# EAGLE design controller (EAGLE 6.6.0)
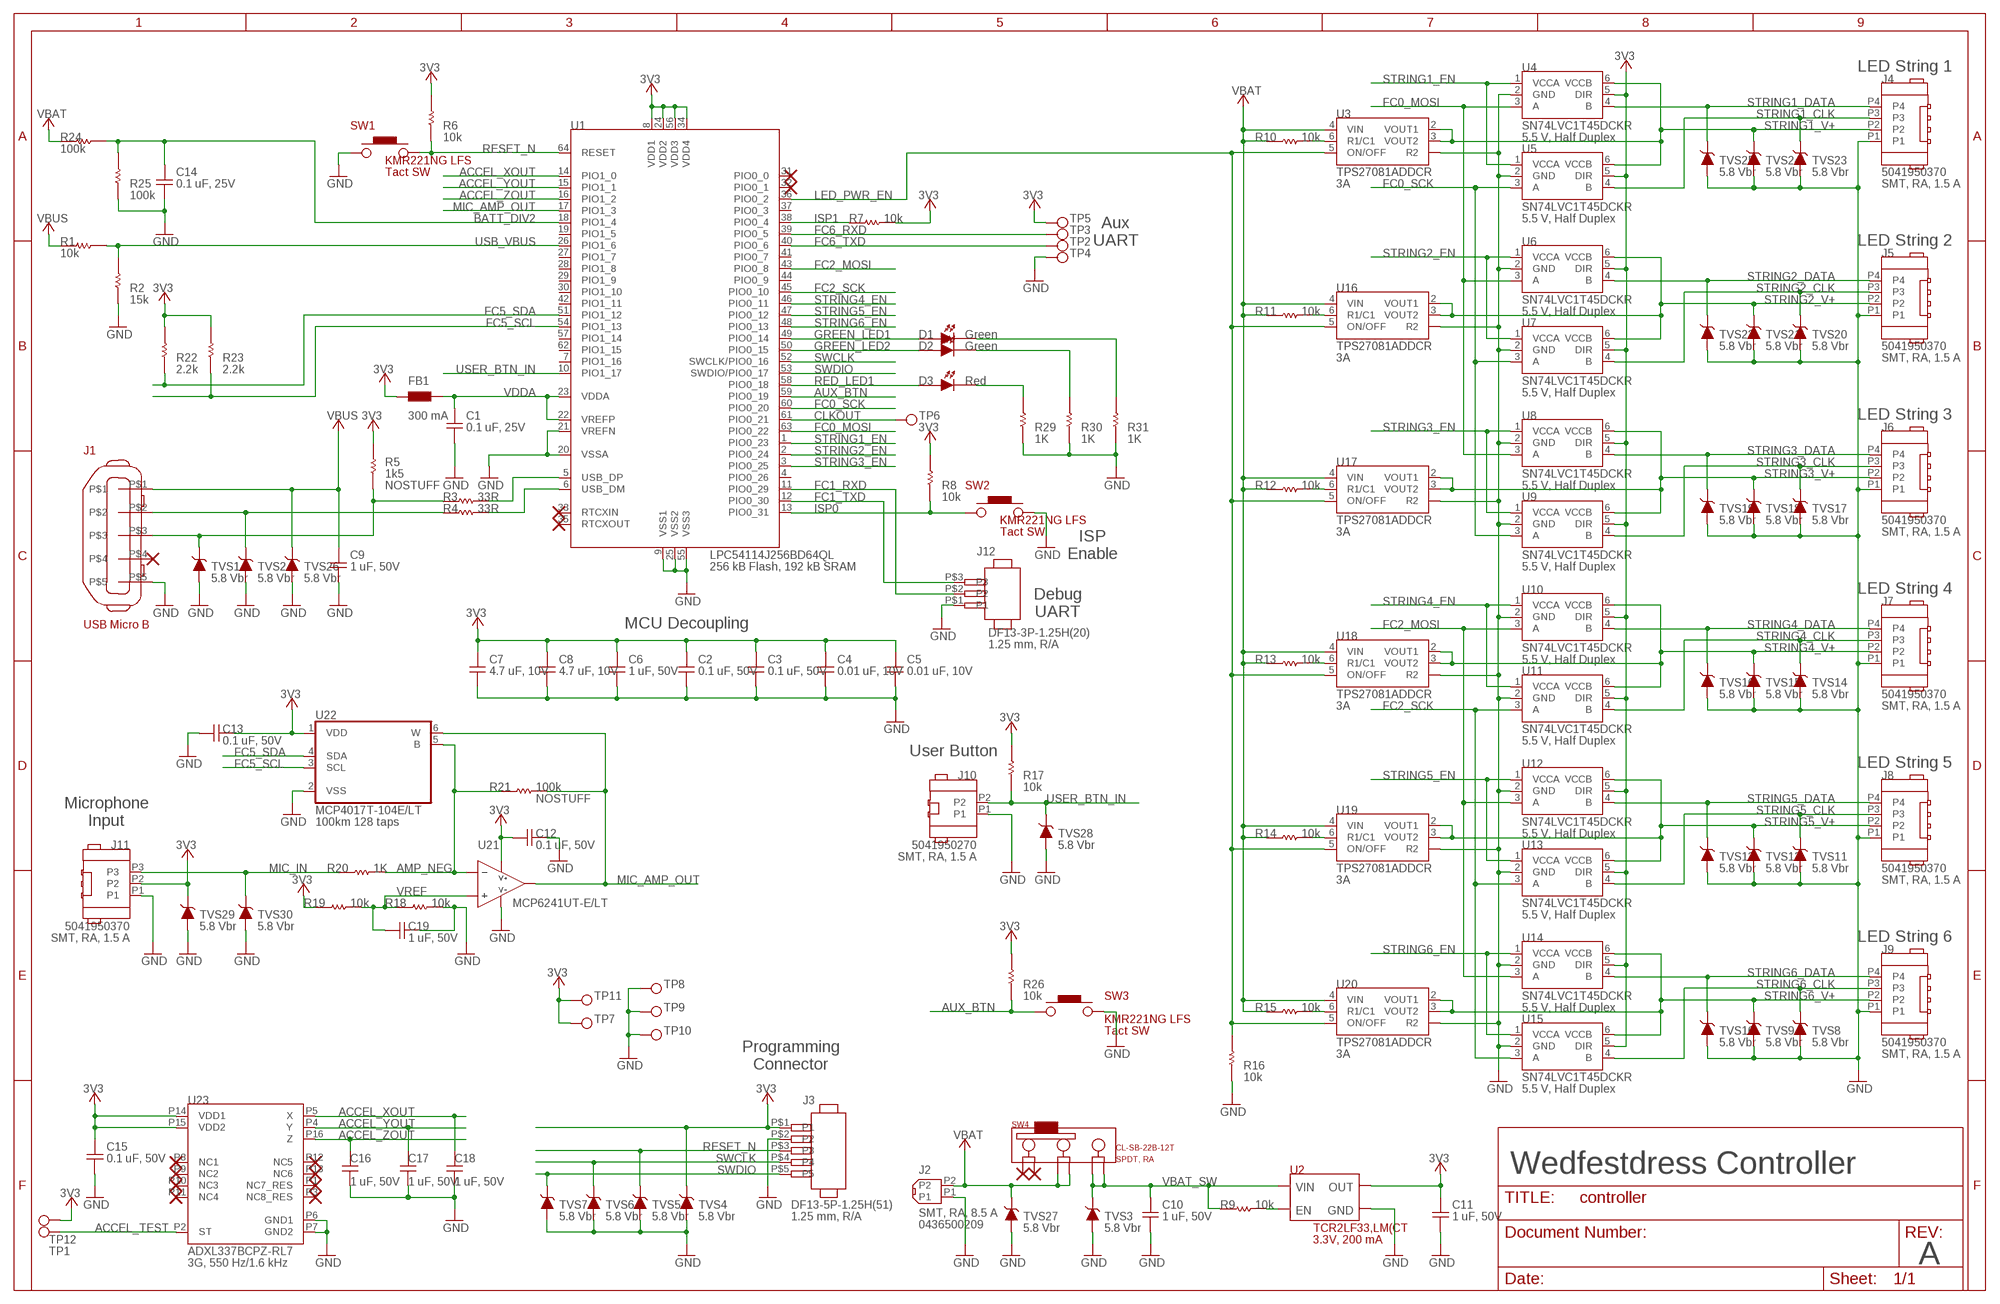
[diagram p0: schematic, sheet 1]

## Parts
C1  CAP_GRM188R71E104KA01D  [CAP_0603]
C2  CAP_C1608X7R1H104K080AA  [CAP_0603]
C3  CAP_C1608X7R1H104K080AA  [CAP_0603]
C4  CAP_CL10B103KB8NNNC  [CAP_0603]
C5  CAP_CL10B103KB8NNNC  [CAP_0603]
C6  CAP_GRM185R61C105KE44D  [CAP_0603]
C7  CAP_CGB3B1X5R1A475M055AC  [CAP_0603]
C8  CAP_CGB3B1X5R1A475M055AC  [CAP_0603]
C9  CAP_GRM185R61C105KE44D  [CAP_0603]
C10  CAP_GRM185R61C105KE44D  [CAP_0603]
C11  CAP_GRM185R61C105KE44D  [CAP_0603]
C12  CAP_C1608X7R1H104K080AA  [CAP_0603]
C13  CAP_C1608X7R1H104K080AA  [CAP_0603]
C14  CAP_GRM188R71E104KA01D  [CAP_0603]
C15  CAP_C1608X7R1H104K080AA  [CAP_0603]
C16  CAP_GRM185R61C105KE44D  [CAP_0603]
C17  CAP_GRM185R61C105KE44D  [CAP_0603]
C18  CAP_GRM185R61C105KE44D  [CAP_0603]
C19  CAP_GRM185R61C105KE44D  [CAP_0603]
D1  LED_LTST-C190GKT  [LED_0603]
D2  LED_LTST-C190GKT  [LED_0603]
D3  LED_LS_Q976-NR-1  [LED_0603_OSRAM]
FB1  FB_BK1608TS102-T  [FB_0603]
J1  10118192-0001LF  [10118192-0001LF]
J2  MOLEX_0436500209  [MOLEX_MICROFIT_2POS_SMT_RA_W_BOSSES]
J3  DF13-5P-1.25H  [DF13-5P-1.25H]
J4  MOLEX_5041950470  [MOLEX_MICROLOCK_RA_4_POS]
J5  MOLEX_5041950470  [MOLEX_MICROLOCK_RA_4_POS]
J6  MOLEX_5041950470  [MOLEX_MICROLOCK_RA_4_POS]
J7  MOLEX_5041950470  [MOLEX_MICROLOCK_RA_4_POS]
J8  MOLEX_5041950470  [MOLEX_MICROLOCK_RA_4_POS]
J9  MOLEX_5041950470  [MOLEX_MICROLOCK_RA_4_POS]
J10  MOLEX_5041950270  [MOLEX_MICROLOCK_RA_2_POS]
J11  MOLEX_5041950370  [MOLEX_MICROLOCK_RA_3_POS]
J12  DF13-3P-1.25H  [DF13-3P-1.25H]
R1  RES_10K_RC0603FR-0710KL  [RES_0603]
R2  RES_15K_RC0603FR-0715KL  [RES_0603]
R3  RES_33R_RC0603FR-0733RL  [RES_0603]
R4  RES_33R_RC0603FR-0733RL  [RES_0603]
R5  RES_1K5_RC0603FR-071K5L  [RES_0603]
R6  RES_10K_RC0603FR-0710KL  [RES_0603]
R7  RES_10K_RC0603FR-0710KL  [RES_0603]
R8  RES_10K_RC0603FR-0710KL  [RES_0603]
R9  RES_10K_RC0603FR-0710KL  [RES_0603]
R10  RES_10K_RC0603FR-0710KL  [RES_0603]
R11  RES_10K_RC0603FR-0710KL  [RES_0603]
R12  RES_10K_RC0603FR-0710KL  [RES_0603]
R13  RES_10K_RC0603FR-0710KL  [RES_0603]
R14  RES_10K_RC0603FR-0710KL  [RES_0603]
R15  RES_10K_RC0603FR-0710KL  [RES_0603]
R16  RES_10K_RC0603FR-0710KL  [RES_0603]
R17  RES_10K_RC0603FR-0710KL  [RES_0603]
R18  RES_10K_RC0603FR-0710KL  [RES_0603]
R19  RES_10K_RC0603FR-0710KL  [RES_0603]
R20  RES_1K_ERJ-3EKF1001V  [RES_0603]
R21  RES_100K_RC0603FR-07100KL  [RES_0603]
R22  RES_2K2_ERJ-3EKF2201V  [RES_0603]
R23  RES_2K2_ERJ-3EKF2201V  [RES_0603]
R24  RES_100K_RC0603FR-07100KL  [RES_0603]
R25  RES_100K_RC0603FR-07100KL  [RES_0603]
R26  RES_10K_RC0603FR-0710KL  [RES_0603]
R29  RES_1K_ERJ-3EKF1001V  [RES_0603]
R30  RES_1K_ERJ-3EKF1001V  [RES_0603]
R31  RES_1K_ERJ-3EKF1001V  [RES_0603]
SW1  KMR221NG  [KMR2]
SW2  KMR221NG  [KMR2]
SW3  KMR221NG  [KMR2]
SW4  CL-SB-22B-12T  [CL-SB-22B-12T]
TP1  TP_1P6_MM_ROUND  [TP_1P6_MM_ROUND]
TP2  TP_1P6_MM_ROUND  [TP_1P6_MM_ROUND]
TP3  TP_1P6_MM_ROUND  [TP_1P6_MM_ROUND]
TP4  TP_1P6_MM_ROUND  [TP_1P6_MM_ROUND]
TP5  TP_1P6_MM_ROUND  [TP_1P6_MM_ROUND]
TP6  TP_1P6_MM_ROUND  [TP_1P6_MM_ROUND]
TP7  TP_1P6_MM_ROUND  [TP_1P6_MM_ROUND]
TP8  TP_1P6_MM_ROUND  [TP_1P6_MM_ROUND]
TP9  TP_1P6_MM_ROUND  [TP_1P6_MM_ROUND]
TP10  TP_1P6_MM_ROUND  [TP_1P6_MM_ROUND]
TP11  TP_1P6_MM_ROUND  [TP_1P6_MM_ROUND]
TP12  TP_1P6_MM_ROUND  [TP_1P6_MM_ROUND]
TVS1  PESD5V0X1UB,135  [SOD523]
TVS2  PESD5V0X1UB,135  [SOD523]
TVS3  PESD5V0X1UB,135  [SOD523]
TVS4  PESD5V0X1UB,135  [SOD523]
TVS5  PESD5V0X1UB,135  [SOD523]
TVS6  PESD5V0X1UB,135  [SOD523]
TVS7  PESD5V0X1UB,135  [SOD523]
TVS8  PESD5V0X1UB,135  [SOD523]
TVS9  PESD5V0X1UB,135  [SOD523]
TVS10  PESD5V0X1UB,135  [SOD523]
TVS11  PESD5V0X1UB,135  [SOD523]
TVS12  PESD5V0X1UB,135  [SOD523]
TVS13  PESD5V0X1UB,135  [SOD523]
TVS14  PESD5V0X1UB,135  [SOD523]
TVS15  PESD5V0X1UB,135  [SOD523]
TVS16  PESD5V0X1UB,135  [SOD523]
TVS17  PESD5V0X1UB,135  [SOD523]
TVS18  PESD5V0X1UB,135  [SOD523]
TVS19  PESD5V0X1UB,135  [SOD523]
TVS20  PESD5V0X1UB,135  [SOD523]
TVS21  PESD5V0X1UB,135  [SOD523]
TVS22  PESD5V0X1UB,135  [SOD523]
TVS23  PESD5V0X1UB,135  [SOD523]
TVS24  PESD5V0X1UB,135  [SOD523]
TVS25  PESD5V0X1UB,135  [SOD523]
TVS26  PESD5V0X1UB,135  [SOD523]
TVS27  PESD5V0X1UB,135  [SOD523]
TVS28  PESD5V0X1UB,135  [SOD523]
TVS29  PESD5V0X1UB,135  [SOD523]
TVS30  PESD5V0X1UB,135  [SOD523]
U1  LPC54114J256BD64  [LQFP64_0P5MM_10X10MM]
U2  TCR2LF33,LM(CT  [TOSHIBA_SMV]
U3  TPS27081  [SOT-23-6_GENERIC]
U4  SN74LVC1T45DCKR  [SC-70-6_GENERIC]
U5  SN74LVC1T45DCKR  [SC-70-6_GENERIC]
U6  SN74LVC1T45DCKR  [SC-70-6_GENERIC]
U7  SN74LVC1T45DCKR  [SC-70-6_GENERIC]
U8  SN74LVC1T45DCKR  [SC-70-6_GENERIC]
U9  SN74LVC1T45DCKR  [SC-70-6_GENERIC]
U10  SN74LVC1T45DCKR  [SC-70-6_GENERIC]
U11  SN74LVC1T45DCKR  [SC-70-6_GENERIC]
U12  SN74LVC1T45DCKR  [SC-70-6_GENERIC]
U13  SN74LVC1T45DCKR  [SC-70-6_GENERIC]
U14  SN74LVC1T45DCKR  [SC-70-6_GENERIC]
U15  SN74LVC1T45DCKR  [SC-70-6_GENERIC]
U16  TPS27081  [SOT-23-6_GENERIC]
U17  TPS27081  [SOT-23-6_GENERIC]
U18  TPS27081  [SOT-23-6_GENERIC]
U19  TPS27081  [SOT-23-6_GENERIC]
U20  TPS27081  [SOT-23-6_GENERIC]
U21  MCP6241UT-E/LT  [SC-70-5_GENERIC]
U22  MCP4017T  [SOT65P210X110-6N]
U23  ADXL337  [ADXL337]

## Nets
3V3: C2.P$1 C3.P$1 C4.P$1 C5.P$1 C6.P$1 C7.P$1 C8.P$1 C11.P$1 C12.P$1 C13.P$2 C15.P$1 FB1.P$1 J3.P$1(P1) J11.P2 R5.P$2 R6.P$2 R7.P$1 R8.P$2 R17.P$2 R19.P$2 R22.P$2 R23.P$2 R26.P$2 TP5.P$1(P1) TP7.P$1(P1) TP11.P$1(P1) TP12.P$1(P1) TVS4.K TVS29.K U1.8(VDD1) U1.24(VDD2) U1.34(VDD4) U1.56(VDD3) U2.P5(OUT) U4.5(DIR) U5.5(DIR) U6.5(DIR) U7.5(DIR) U8.5(DIR) U9.5(DIR) U10.5(DIR) U11.5(DIR) U12.5(DIR) U13.5(DIR) U14.5(DIR) U15.5(DIR) U21.5(V+) U22.1(VDD) U23.P14(VDD1) U23.P15(VDD2)
+6V: C9.P$1 J1.P$1 R1.P$2 TVS26.K ; supply symbol labelled VBUS
ACCEL_TEST: TP1.P$1(P1) U23.P2(ST)
ACCEL_XOUT: C18.P$1 U1.14(PIO1_0) U23.P5(X)
ACCEL_YOUT: C17.P$1 U1.15(PIO1_1) U23.P4(Y)
ACCEL_ZOUT: C16.P$1 U1.16(PIO1_2) U23.P16(Z)
AMP_NEG: R20.P$2 R21.P$1 U21.3(IN-) U22.5(B)
AUX_BTN: R26.P$1 SW3.P1 U1.59(PIO0_19)
BATT_DIV2: C14.P$1 R24.P$1 R25.P$2 U1.18(PIO1_4)
CLKOUT: TP6.P$1(P1) U1.61(PIO0_21)
FC0_MOSI: U1.63(PIO0_22) U4.3(A) U6.3(A) U8.3(A)
FC0_SCK: U1.60(PIO0_20) U5.3(A) U7.3(A) U9.3(A)
FC1_RXD: J12.P$2(P2) U1.11(PIO0_29)
FC1_TXD: J12.P$3(P3) U1.12(PIO0_30)
FC2_MOSI: U1.43(PIO0_8) U10.3(A) U12.3(A) U14.3(A)
FC2_SCK: U1.45(PIO0_10) U11.3(A) U13.3(A) U15.3(A)
FC5_SCL: R23.P$1 U1.54(PIO1_13) U22.3(SCL)
FC5_SDA: R22.P$1 U1.51(PIO1_12) U22.4(SDA)
FC6_RXD: TP3.P$1(P1) U1.39(PIO0_5)
FC6_TXD: TP2.P$1(P1) U1.40(PIO0_6)
GND: C1.P$2 C2.P$2 C3.P$2 C4.P$2 C5.P$2 C6.P$2 C7.P$2 C8.P$2 C9.P$2 C10.P$2 C11.P$2 C12.P$2 C13.P$1 C14.P$2 C15.P$2 C16.P$2 C17.P$2 C18.P$2 C19.P$2 J1.P$5 J2.P1 J3.P$2(P2) J4.P1 J5.P1 J6.P1 J7.P1 J8.P1 J9.P1 J10.P1 J11.P1 J12.P$1(P1) R2.P$1 R16.P$1 R18.P$1 R25.P$1 R29.P$1 R30.P$1 R31.P$1 SW1.P1 SW2.P3(P2) SW3.P3(P2) TP4.P$1(P1) TP8.P$1(P1) TP9.P$1(P1) TP10.P$1(P1) TVS1.A TVS2.A TVS3.A TVS4.A TVS5.A TVS6.A TVS7.A TVS8.A TVS9.A TVS10.A TVS11.A TVS12.A TVS13.A TVS14.A TVS15.A TVS16.A TVS17.A TVS18.A TVS19.A TVS20.A TVS21.A TVS22.A TVS23.A TVS24.A TVS25.A TVS26.A TVS27.A TVS28.A TVS29.A TVS30.A U1.9(VSS1) U1.20(VSSA) U1.21(VREFN) U1.25(VSS2) U1.55(VSS3) U2.P2(GND) U3.1(R2) U4.2(GND) U5.2(GND) U6.2(GND) U7.2(GND) U8.2(GND) U9.2(GND) U10.2(GND) U11.2(GND) U12.2(GND) U13.2(GND) U14.2(GND) U15.2(GND) U16.1(R2) U17.1(R2) U18.1(R2) U19.1(R2) U20.1(R2) U21.2(V-) U22.2(VSS) U23.P6(GND1) U23.P7(GND2)
GREEN_LED1: D1.A U1.49(PIO0_14)
GREEN_LED2: D2.A U1.50(PIO0_15)
ISP0: R8.P$1 SW2.P1 U1.13(PIO0_31)
ISP1: R7.P$2 U1.38(PIO0_4)
LED_PWR_EN: R16.P$2 U1.36(PIO0_2) U3.5(ON/OFF) U16.5(ON/OFF) U17.5(ON/OFF) U18.5(ON/OFF) U19.5(ON/OFF) U20.5(ON/OFF)
MIC_AMP_OUT: R21.P$2 U1.17(PIO1_3) U21.4(OUT) U22.6(W)
MIC_IN: J11.P3 R20.P$1 TVS30.K
N$1: R10.P$2 U3.6(R1/C1)
N$2: R3.P$2 U1.5(USB_DP)
N$3: R4.P$2 U1.6(USB_DM)
N$4: J1.P$2 R4.P$1 TVS2.K
N$5: J1.P$3 R3.P$1 R5.P$1 TVS1.K
N$6: R9.P$1 U2.P3(EN)
N$10: D3.K R29.P$2
N$11: D2.K R30.P$2
N$12: D1.K R31.P$2
N$16: R15.P$2 U20.6(R1/C1)
N$17: R11.P$2 U16.6(R1/C1)
N$19: R12.P$2 U17.6(R1/C1)
N$21: R13.P$2 U18.6(R1/C1)
N$23: R14.P$2 U19.6(R1/C1)
RED_LED1: D3.A U1.58(PIO0_18)
RESET_N: J3.P$3(P3) R6.P$1 SW1.P3(P2) TVS5.K U1.64(RESET)
STRING1_CLK: J4.P3 TVS23.K U5.4(B)
STRING1_DATA: J4.P4 TVS25.K U4.4(B)
STRING1_EN: U1.1(PIO0_23) U4.1(VCCA) U5.1(VCCA)
STRING1_V+: J4.P2 TVS24.K U3.2(VOUT1) U3.3(VOUT2) U4.6(VCCB) U5.6(VCCB)
STRING2_CLK: J5.P3 TVS20.K U7.4(B)
STRING2_DATA: J5.P4 TVS22.K U6.4(B)
STRING2_EN: U1.2(PIO0_24) U6.1(VCCA) U7.1(VCCA)
STRING2_V+: J5.P2 TVS21.K U6.6(VCCB) U7.6(VCCB) U16.2(VOUT1) U16.3(VOUT2)
STRING3_CLK: J6.P3 TVS17.K U9.4(B)
STRING3_DATA: J6.P4 TVS19.K U8.4(B)
STRING3_EN: U1.3(PIO0_25) U8.1(VCCA) U9.1(VCCA)
STRING3_V+: J6.P2 TVS18.K U8.6(VCCB) U9.6(VCCB) U17.2(VOUT1) U17.3(VOUT2)
STRING4_CLK: J7.P3 TVS14.K U11.4(B)
STRING4_DATA: J7.P4 TVS16.K U10.4(B)
STRING4_EN: U1.46(PIO0_11) U10.1(VCCA) U11.1(VCCA)
STRING4_V+: J7.P2 TVS15.K U10.6(VCCB) U11.6(VCCB) U18.2(VOUT1) U18.3(VOUT2)
STRING5_CLK: J8.P3 TVS11.K U13.4(B)
STRING5_DATA: J8.P4 TVS13.K U12.4(B)
STRING5_EN: U1.47(PIO0_12) U12.1(VCCA) U13.1(VCCA)
STRING5_V+: J8.P2 TVS12.K U12.6(VCCB) U13.6(VCCB) U19.2(VOUT1) U19.3(VOUT2)
STRING6_CLK: J9.P3 TVS8.K U15.4(B)
STRING6_DATA: J9.P4 TVS10.K U14.4(B)
STRING6_EN: U1.48(PIO0_13) U14.1(VCCA) U15.1(VCCA)
STRING6_V+: J9.P2 TVS9.K U14.6(VCCB) U15.6(VCCB) U20.2(VOUT1) U20.3(VOUT2)
SWCLK: J3.P$4(P4) TVS6.K U1.52(SWCLK/PIO0_16)
SWDIO: J3.P$5(P5) TVS7.K U1.53(SWDIO/PIO0_17)
USB_VBUS: R1.P$1 R2.P$2 U1.26(PIO1_6)
USER_BTN_IN: J10.P2 R17.P$1 TVS28.K U1.10(PIO1_17)
VBAT: J2.P2 R10.P$1 R11.P$1 R12.P$1 R13.P$1 R14.P$1 R15.P$1 R24.P$2 SW4.3 SW4.4 TVS27.K U3.4(VIN) U16.4(VIN) U17.4(VIN) U18.4(VIN) U19.4(VIN) U20.4(VIN)
VBAT_SW: C10.P$1 R9.P$2 SW4.5 SW4.6 TVS3.K U2.P1(VIN)
VDDA: C1.P$1 FB1.P$2 U1.22(VREFP) U1.23(VDDA)
VREF: C19.P$1 R18.P$2 R19.P$1 U21.1(IN+)
Unconnected: J1.P$4 SW4.1 SW4.2 U1.4(PIO0_26) U1.7(PIO1_16) U1.19(PIO1_5) U1.27(PIO1_7) U1.28(PIO1_8) U1.29(PIO1_9) U1.30(PIO1_10) U1.31(PIO0_0) U1.32(PIO0_1) U1.33(RTCXIN) U1.35(RTCXOUT) U1.37(PIO0_3) U1.41(PIO0_7) U1.42(PIO1_11) U1.44(PIO0_9) U1.57(PIO1_14) U1.62(PIO1_15) U23.P1(NC7_RES) U23.P3(NC8_RES) U23.P8(NC1) U23.P9(NC2) U23.P10(NC3) U23.P11(NC4) U23.P12(NC5) U23.P13(NC6)

## Notes on the sheet
- LED String 1
- Aux
  UART
- LED String 2
- LED String 3
- ISP
  Enable
- LED String 4
- Debug
  UART
- MCU Decoupling
- User Button
- LED String 5
- Microphone
  Input
- LED String 6
- Programming
  Connector
- Wedfestdress Controller
- A

## Library data of the parts
C1 C14 = wedfestdress:CAP_GRM188R71E104KA01D; COST_X1: 0.1; COST_X100: 0.0088; COST_X500: 0.00616; DESCRIPTION: Capacitor, 0.1 uF, 25V, 0603, X7R; DISPLAY: 0.1 uF, 25V; DISTRIBUTOR: Digikey; DIST_PART_NO: 490-1524-1-ND; MFG: Murata; MFG_PART_NO: GRM188R71E104KA01D; PACKAGE: 0603
C2 C3 C12 C13 C15 = wedfestdress:CAP_C1608X7R1H104K080AA; COST_X1: 0.1; COST_X100: 0.022; COST_X500: 0.0154; DESCRIPTION: Capacitor, 0.1 uF, 50V, 0603, X7R; DISPLAY: 0.1 uF, 50V; DISTRIBUTOR: Digikey; DIST_PART_NO: 445-1314-1-ND; MFG: TDK; MFG_PART_NO: C1608X7R1H104K080AA; PACKAGE: 0603
C4 C5 = wedfestdress:CAP_CL10B103KB8NNNC; COST_X1: 0.1; COST_X100: 0.0078; COST_X500: 0.00542; DESCRIPTION: Capacitor, 10 nF, 50V, 0603, X7R; DISPLAY: 0.01 uF, 10V; DISTRIBUTOR: Digikey; DIST_PART_NO: 1276-1009-1-ND; MFG: Samsung; MFG_PART_NO: CL10B103KB8NNNC; PACKAGE: 0603
C6 C9-C11 C16-C19 = wedfestdress:CAP_GRM185R61C105KE44D; COST_X1: 0.11; COST_X100: 0.0356; COST_X500: 0.02512; DESCRIPTION: Capacitor, 1 uF, 16V, 0603, X5R; DISPLAY: 1 uF, 50V; DISTRIBUTOR: Digikey; DIST_PART_NO: 490-3894-1-ND; MFG: Murata; MFG_PART_NO: GRM185R61C105KE44D; PACKAGE: 0603
C7 C8 = wedfestdress:CAP_CGB3B1X5R1A475M055AC; COST_X1: 0.24; COST_X100: 0.1; COST_X500: 0.06626; DESCRIPTION: Capacitor, 4.7 uF, 10V, 0603, X5R; DISPLAY: 4.7 uF, 10V; DISTRIBUTOR: Digikey; DIST_PART_NO: 445-7483-1-ND; MFG: TDK; MFG_PART_NO: CGB3B1X5R1A475M055AC; PACKAGE: 0603
D1 D2 = wedfestdress:LED_LTST-C190GKT; COST_X1: 0.29; COST_X100: 0.1242; COST_X500: 0.07038; DESCRIPTION: LED, Green, Clear, 6 mcd @ 10 mA, 0603; DISPLAY: Green; DISTRIBUTOR: Digikey; DIST_PART_NO: 160-1183-1-ND; MFG: Lite-On; MFG_PART_NO: LTST-C190GKT; PACKAGE: 0603
D3 = wedfestdress:LED_LS_Q976-NR-1; COST_X1: 0.1; COST_X100: 0.035; COST_X500: 0.035; DESCRIPTION: LED, Red, 104 mcd @ 20 mA, 0603; DISPLAY: Red; DISTRIBUTOR: Digikey; DIST_PART_NO: 475-2512-1-ND; MFG: OSRAM; MFG_PART_NO: LS Q976-NR-1; PACKAGE: 0603
FB1 = wedfestdress:FB_BK1608TS102-T; COST_X1: 0.1; COST_X100: 0.0426; COST_X500: 0.0227; DESCRIPTION: Ferrite Bead, 1k @ 100 MHz, 300 mOhm DCR, 300 mA, 0603 package; DISPLAY: 300 mA; DISTRIBUTOR: Digikey; DIST_PART_NO: 587-1895-1-ND; MFG: Taiyo Yuden; MFG_PART_NO: BK1608TS102-T; PACKAGE: 0603
J1 = wedfestdress:10118192-0001LF; COST_X1: 0.46; COST_X100: 0.3032; COST_X500: 0.25988; DESCRIPTION: USB Micro B; DISPLAY: USB Micro B; DISTRIBUTOR: Digikey; DIST_PART_NO: 609-4613-1-ND; MFG: FCI; MFG_PART_NO: 10118192-0001LF; PACKAGE: SMT
J2 = wedfestdress:MOLEX_0436500209; COST_X1: 2.03; COST_X100: 1.5782; COST_X500: 1.5782; DESCRIPTION: Connector, 2 position, 3 mm pitch, SMT, RA, 8.5 A per pin; DISPLAY: SMT, RA, 8.5 A; DISTRIBUTOR: Digikey; DIST_PART_NO: WM1880CT-ND; MFG: Molex; MFG_PART_NO: 0436500209; PACKAGE: SMT
J3 = wedfestdress:DF13-5P-1.25H; COST_X1: 1.24; COST_X100: 0.9438; COST_X500: 0.7722; DESCRIPTION: Connector, 5 pin, 1.25 mm pitch, SMT, R/A; DISPLAY: 1.25 mm, R/A; DISTRIBUTOR: Digikey; DIST_PART_NO: H121936CT-ND; MFG: Hirose; MFG_PART_NO: DF13-5P-1.25H(51); PACKAGE: SMT
J4-J9 = wedfestdress:MOLEX_5041950470; COST_X1: 1.28; COST_X100: 0.968; COST_X500: 0.792; DESCRIPTION: Connector, 4 position, 1.25 mm pitch, SMT, RA, 1.5 A per pin; DISPLAY: SMT, RA, 1.5 A; DISTRIBUTOR: Digikey; DIST_PART_NO: WM10584CT-ND; MFG: Molex; MFG_PART_NO: 5041950370; PACKAGE: SMT
J10 = wedfestdress:MOLEX_5041950270; COST_X1: 0.91; COST_X100: 0.6938; COST_X500: 0.56766; DESCRIPTION: Connector, 2 position, 1.25 mm pitch, SMT, RA, 1.5 A per pin; DISPLAY: SMT, RA, 1.5 A; DISTRIBUTOR: Digikey; DIST_PART_NO: WM10583CT-ND; MFG: Molex; MFG_PART_NO: 5041950270; PACKAGE: SMT
J11 = wedfestdress:MOLEX_5041950370; COST_X1: 1.28; COST_X100: 0.968; COST_X500: 0.792; DESCRIPTION: Connector, 3 position, 1.25 mm pitch, SMT, RA, 1.5 A per pin; DISPLAY: SMT, RA, 1.5 A; DISTRIBUTOR: Digikey; DIST_PART_NO: WM10584CT-ND; MFG: Molex; MFG_PART_NO: 5041950370; PACKAGE: SMT
J12 = wedfestdress:DF13-3P-1.25H; COST_X1: 0.46; COST_X100: 0.3284; COST_X500: 0.2856; DESCRIPTION: Connector, 3 pin, 1.25 mm pitch, SMT, R/A; DISPLAY: 1.25 mm, R/A; DISTRIBUTOR: Digikey; DIST_PART_NO: H2220-ND; MFG: Hirose; MFG_PART_NO: DF13-3P-1.25H(20); PACKAGE: SMT
R1 R6-R19 R26 = wedfestdress:RES_10K_RC0603FR-0710KL; COST_X1: .01; COST_X100: .0063; COST_X500: .00382; DESCRIPTION: Resistor, 10k, 1%, 0603, 100 ppm/C; DISPLAY: 10k; DISTRIBUTOR: Digikey; DIST_PART_NO: 311-10.0KHRCT-ND; MFG: Yageo; MFG_PART_NO: RC0603FR-0710KL; PACKAGE: 0603
R2 = wedfestdress:RES_15K_RC0603FR-0715KL; COST_X1: 0.1; COST_X100: 0.0057; COST_X500: 0.00348; DESCRIPTION: Resistor, 15k, 1%, 0603; DISPLAY: 15k; DISTRIBUTOR: Digikey; DIST_PART_NO: 311-15.0KHRCT-ND; MFG: Yageo; MFG_PART_NO: RC0603FR-0715KL; PACKAGE: 0603
R3 R4 = wedfestdress:RES_33R_RC0603FR-0733RL; COST_X1: 0.1; COST_X100: 0.0057; COST_X500: 0.00348; DESCRIPTION: Resistor, 33R, 0603; DISPLAY: 33R; DISTRIBUTOR: Digikey; DIST_PART_NO: 311-33.0HRCT-ND; MFG: Yageo; MFG_PART_NO: RC0603FR-0733RL; PACKAGE: 0603
R5 = wedfestdress:RES_1K5_RC0603FR-071K5L; COST_X1: 0.1; COST_X100: 0.0057; COST_X500: 0.00348; DESCRIPTION: Resistor, 1.5k, 1%, 0603; DISPLAY: 1k5; DISTRIBUTOR: Digikey; DIST_PART_NO: 311-1.50KHRCT-ND; MFG: Yageo; MFG_PART_NO: RC0603FR-071K5L; NOSTUFF: NOSTUFF; PACKAGE: 0603
R20 R29-R31 = wedfestdress:RES_1K_ERJ-3EKF1001V; COST_X1: 0.1; COST_X100: 0.01140; COST_X500: 0.00624; DESCRIPTION: Resistor, 1K, 1%, 0603; DISPLAY: 1K; DISTRIBUTOR: Digikey; DIST_PART_NO: P1.00KHCT-ND; MFG: Panasonic; MFG_PART_NO: ERJ-3EKF1001V; PACKAGE: 0603
R21 = wedfestdress:RES_100K_RC0603FR-07100KL; COST_X1: 0.1; COST_X100: .0052; COST_X500: .00316; DESCRIPTION: Resistor, 100k, 1%, 0603, 100 ppm/C; DISPLAY: 100k; DISTRIBUTOR: Digikey; DIST_PART_NO: 311-100KHRCT-ND; MFG: Yageo; MFG_PART_NO: RC0603FR-07100KL; NOSTUFF: NOSTUFF; PACKAGE: 0603
R22 R23 = wedfestdress:RES_2K2_ERJ-3EKF2201V; COST_X1: .1; COST_X100: .0084; COST_X500: .00514; DESCRIPTION: Resistor, 2.2k, 1%, 0603, 100 ppm/C; DISPLAY: 2.2k; DISTRIBUTOR: Digikey; DIST_PART_NO: P2.20KHCT-ND; MFG: Panasonic; MFG_PART_NO: ERJ-3EKF2201V; PACKAGE: 0603
R24 R25 = wedfestdress:RES_100K_RC0603FR-07100KL; COST_X1: 0.1; COST_X100: .0052; COST_X500: .00316; DESCRIPTION: Resistor, 100k, 1%, 0603, 100 ppm/C; DISPLAY: 100k; DISTRIBUTOR: Digikey; DIST_PART_NO: 311-100KHRCT-ND; MFG: Yageo; MFG_PART_NO: RC0603FR-07100KL; PACKAGE: 0603
SW1-SW3 = wedfestdress:KMR221NG; COST_X1: 0.51; COST_X100: 0.4017; COST_X500: 0.34694; DESCRIPTION: Tact Switch, SPST, Vert; DISPLAY: Tact SW; DISTRIBUTOR: Digikey; DIST_PART_NO: CKN10244CT-ND; MFG: C and K; MFG_PART_NO: KMR221NG LFS; PACKAGE: SMT
SW4 = wedfestdress:CL-SB-22B-12T; COST_X1: 1.35; COST_X100: 1.0771; COST_X500: 1.0502; DESCRIPTION: Switch, SPDT, Sub-Miniature, RA, SMT; DISPLAY: SPDT, RA; DISTRIBUTOR: Digikey; DIST_PART_NO: 563-1345-1-ND; MFG: Copal; MFG_PART_NO: CL-SB-22B-12T; PACKAGE: SMT
TP1-TP12 = wedfestdress:TP_1P6_MM_ROUND: Test Point 1.6 mm Round; DESCRIPTION: Test point, SMT, circular, 1.6 mm diameter; DISPLAY: Test Point
TVS1-TVS30 = wedfestdress:PESD5V0X1UB,135; COST_X1: 0.45; COST_X100: 0.288; COST_X500: 0.22626; DESCRIPTION: TVS diode, 5 Vs, 5.8 Vbr, 8 Vcl, 0.95 pF, 8 kV, 200 mW; DISPLAY: 5.8 Vbr; DISTRIBUTOR: Digikey; DIST_PART_NO: 1727-5906-1-ND; MFG: NXP; MFG_PART_NO: PESD5V0X1UB,135; PACKAGE: SOD523
U1 = wedfestdress:LPC54114J256BD64; COST_X1: 7.79; COST_X100: 5.8259; COST_X500: 5.07316; DESCRIPTION: Microcontroller, Cortex M4F + Cortex M0+, 100 MHz, 256 kB flash, 192 kB SRAM; DISPLAY: 256 kB Flash, 192 kB SRAM; DISTRIBUTOR: Digikey; DIST_PART_NO: 568-13034-ND; MFG: NXP; MFG_PART_NO: LPC54114J256BD64QL; PACKAGE: LQFP64
U2 = wedfestdress:TCR2LF33,LM(CT; COST_X1: 0.45; COST_X100: 0.1911; COST_X500: 0.10816; DESCRIPTION: LDO, 3.3V, 200 mA, 1%, 0.22V dropout; DISPLAY: 3.3V, 200 mA; DISTRIBUTOR: Digikey; DIST_PART_NO: TCR2LF33LM(CTCT-ND; MFG: Toshiba; MFG_PART_NO: TCR2LF33,LM(CT; PACKAGE: SMV
U3 U16-U20 = wedfestdress:TPS27081; COST_X1: 0.44; COST_X100: 0.2781; COST_X500: 0.2043; DESCRIPTION: Load switch, high side, 3A; DISPLAY: 3A; DISTRIBUTOR: Digikey; DIST_PART_NO: 296-34970-1-ND; MFG: TI; MFG_PART_NO: TPS27081ADDCR; PACKAGE: SOT-23-6
U4-U15 = wedfestdress:SN74LVC1T45DCKR; COST_X1: 0.58; COST_X100: 0.3699; COST_X500: 0.29056; DESCRIPTION: Level shifter, 1 channel, 5.5 V; DISPLAY: 5.5 V, Half Duplex; DISTRIBUTOR: Digikey; DIST_PART_NO: 296-16844-1-ND; MFG: Texas Instruments; MFG_PART_NO: SN74LVC1T45DCKR; PACKAGE: SC-70-6
U21 = wedfestdress:MCP6241UT-E/LT; COST_X1: 0.31; COST_X100: 0.2369; COST_X500: 0.2369; DESCRIPTION: OpAmp, 500 kHz GBWP, rail-to-rail, 50 uA Iq; DISTRIBUTOR: Digikey; DIST_PART_NO: MCP6241UT-E/LTCT-ND; MFG: Microchip; MFG_PART_NO: MCP6241UT-E/LT; PACKAGE: SC-70-5
U22 = wedfestdress:MCP4017T: MCP4017 IC, 7-Bit Single I2C Digital Rheostat with Volatile Memory in SC-70-6 Features • Potentiometer or Rheostat configuration options • 7-bit: Resistor Network Resolution - 127 Resistors (128 Steps) • Zero Scale to Full Scale Wiper operation • RAB Resistances: 5 kΩ, 10 kΩ, 50 kΩ, or 100 kΩ • Low Wiper Resistance: 100Ω (typical) • Low Tempco: - Absolute (Rheostat): 50 ppm typical (0°C to 70°C) - Ratiometric (Potentiometer): 10 ppm typical • Simple I2C Protocol with read & write commands • Brown-out reset protection (1.5V typical) • Power-on Default Wiper Setting (Mid-scale) • Low-Power Operation: - 2.5 μA Static Current (typical) • Wide Operating Voltage Range: - 2.7V to 5.5V - Device Characteristics Specified - 1.8V to 5.5V - Device Operation • Wide Bandwidth (-3 dB) Operation: - 2 MHz (typical) for 5.0 kΩ device • Extended temperature range (-40°C to +125°C) • Very small package (SC70) • Lead free (Pb-free) package; COST_X1: 0.53; COST_X100: 0.4017; COST_X500: 0.4017; DESCRIPTION: Digital potentiometer, 100k, 100 taps, I2C; DISPLAY: 100km 128 taps; DISTRIBUTOR: Digikey; DIST_PART_NO: MCP4017T-104E/LTCT-ND; MFG: Microchip; MFG_PART_NO: MCP4017T-104E/LT; PACKAGE: SC-70-6
U23 = wedfestdress:ADXL337; COST_X1: 4.58; COST_X100: 3.3677; COST_X500: 2.86682; DESCRIPTION: Accelerometer, 3G, 550 Hz / 1.6 kHz; DISPLAY: 3G, 550 Hz/1.6 kHz; DISTRIBUTOR: Digikey; DIST_PART_NO: ADXL337BCPZ-RL7CT-ND; MFG: Analog Devices; MFG_PART_NO: ADXL337BCPZ-RL7; PACKAGE: SMT

## Board
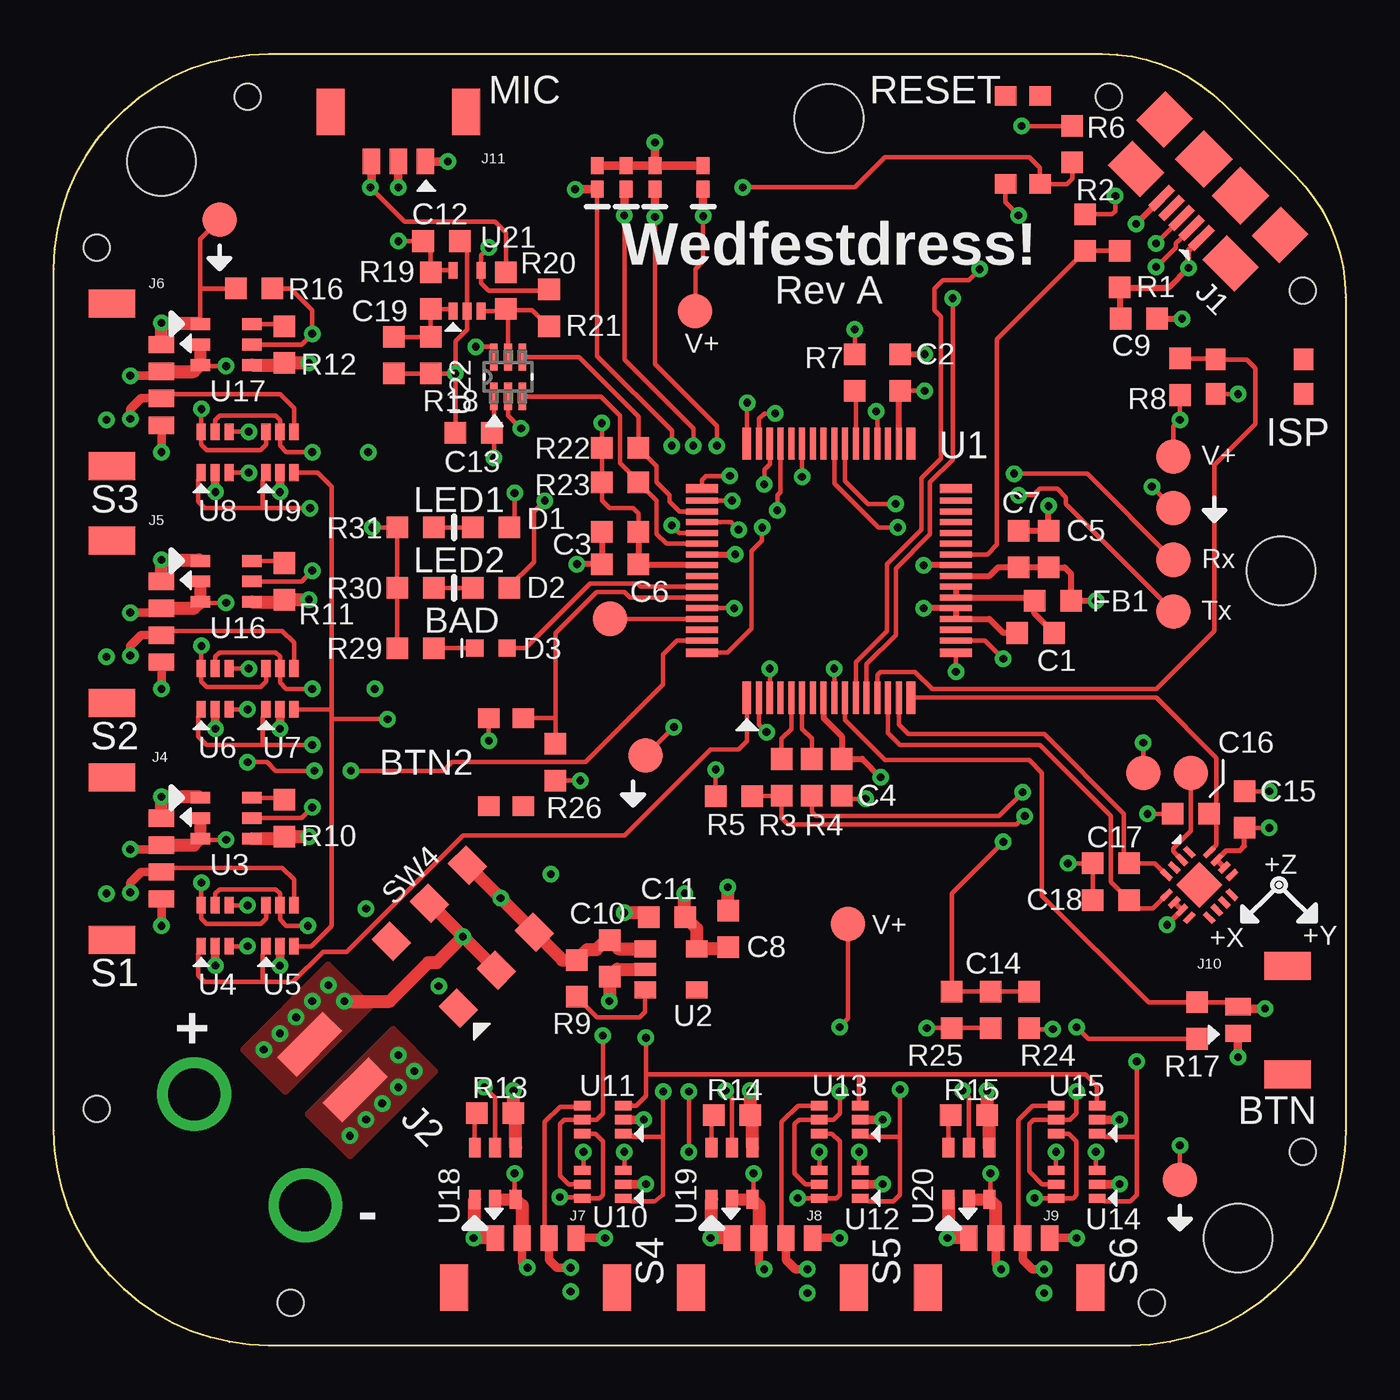
[diagram p1: board, top side]
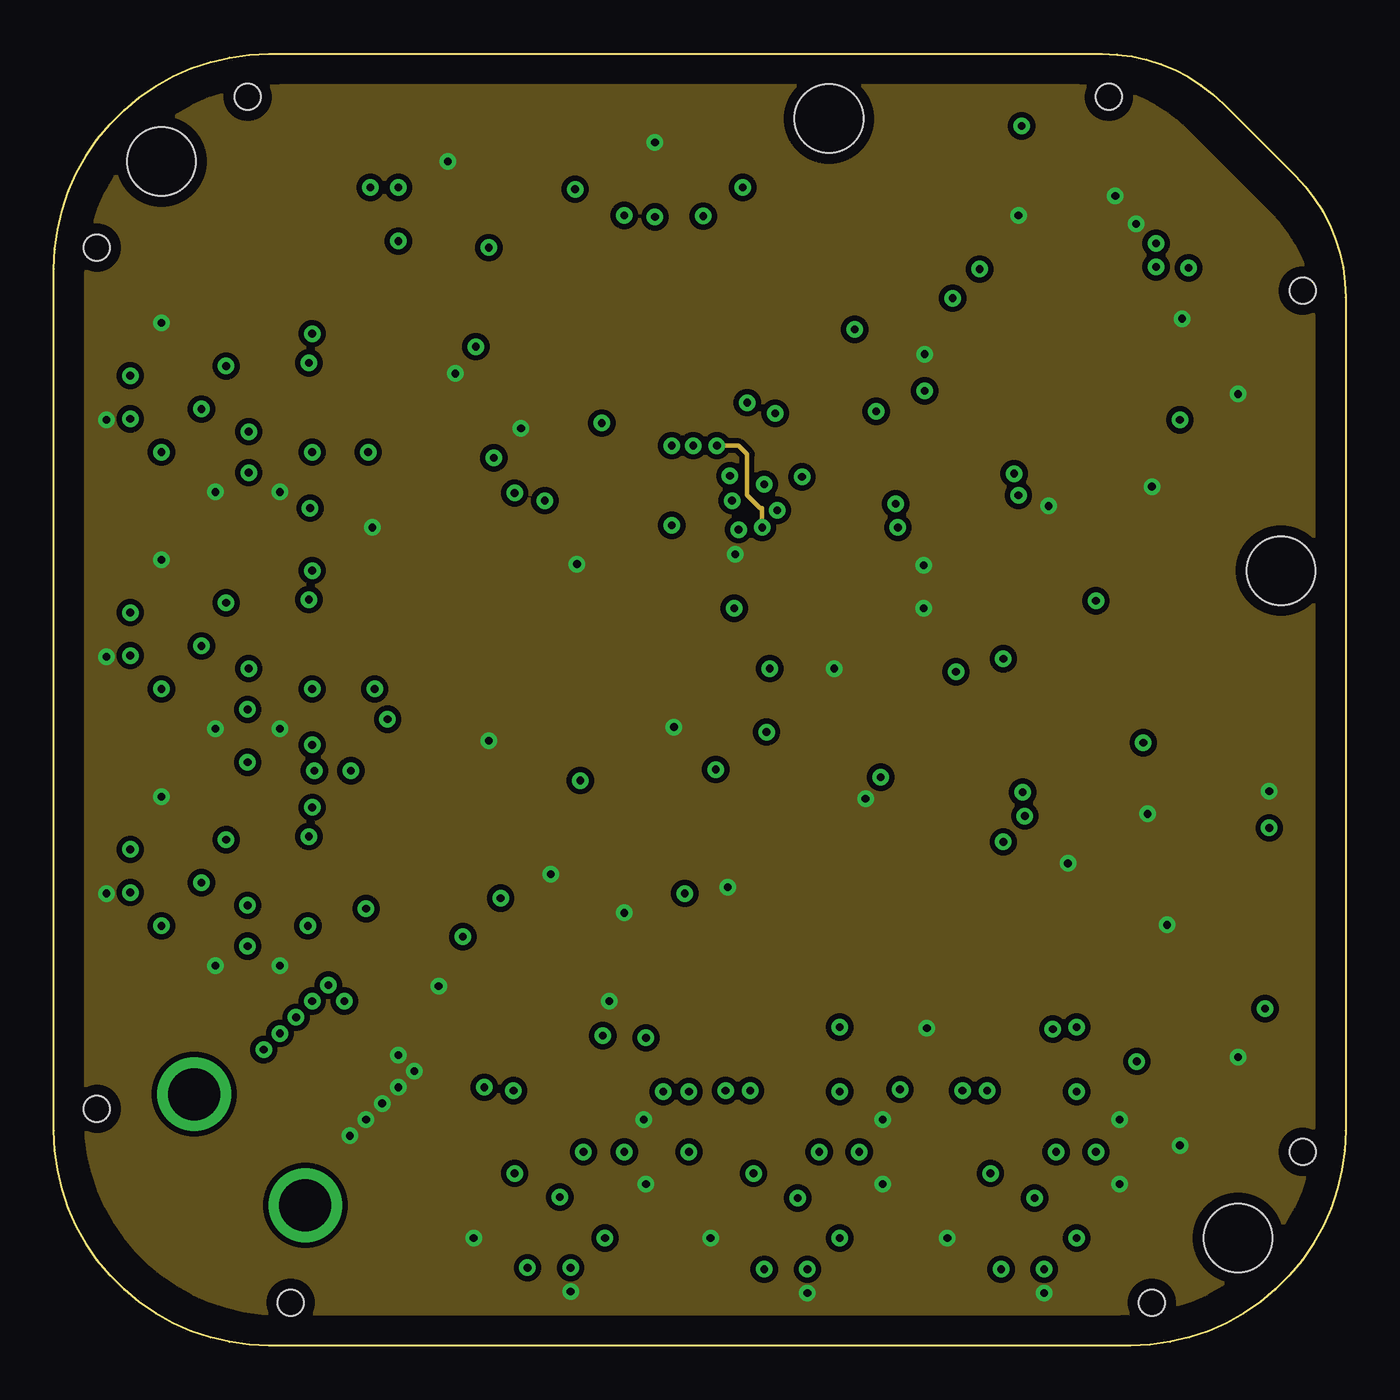
[diagram p2: board, inner layer Route2]
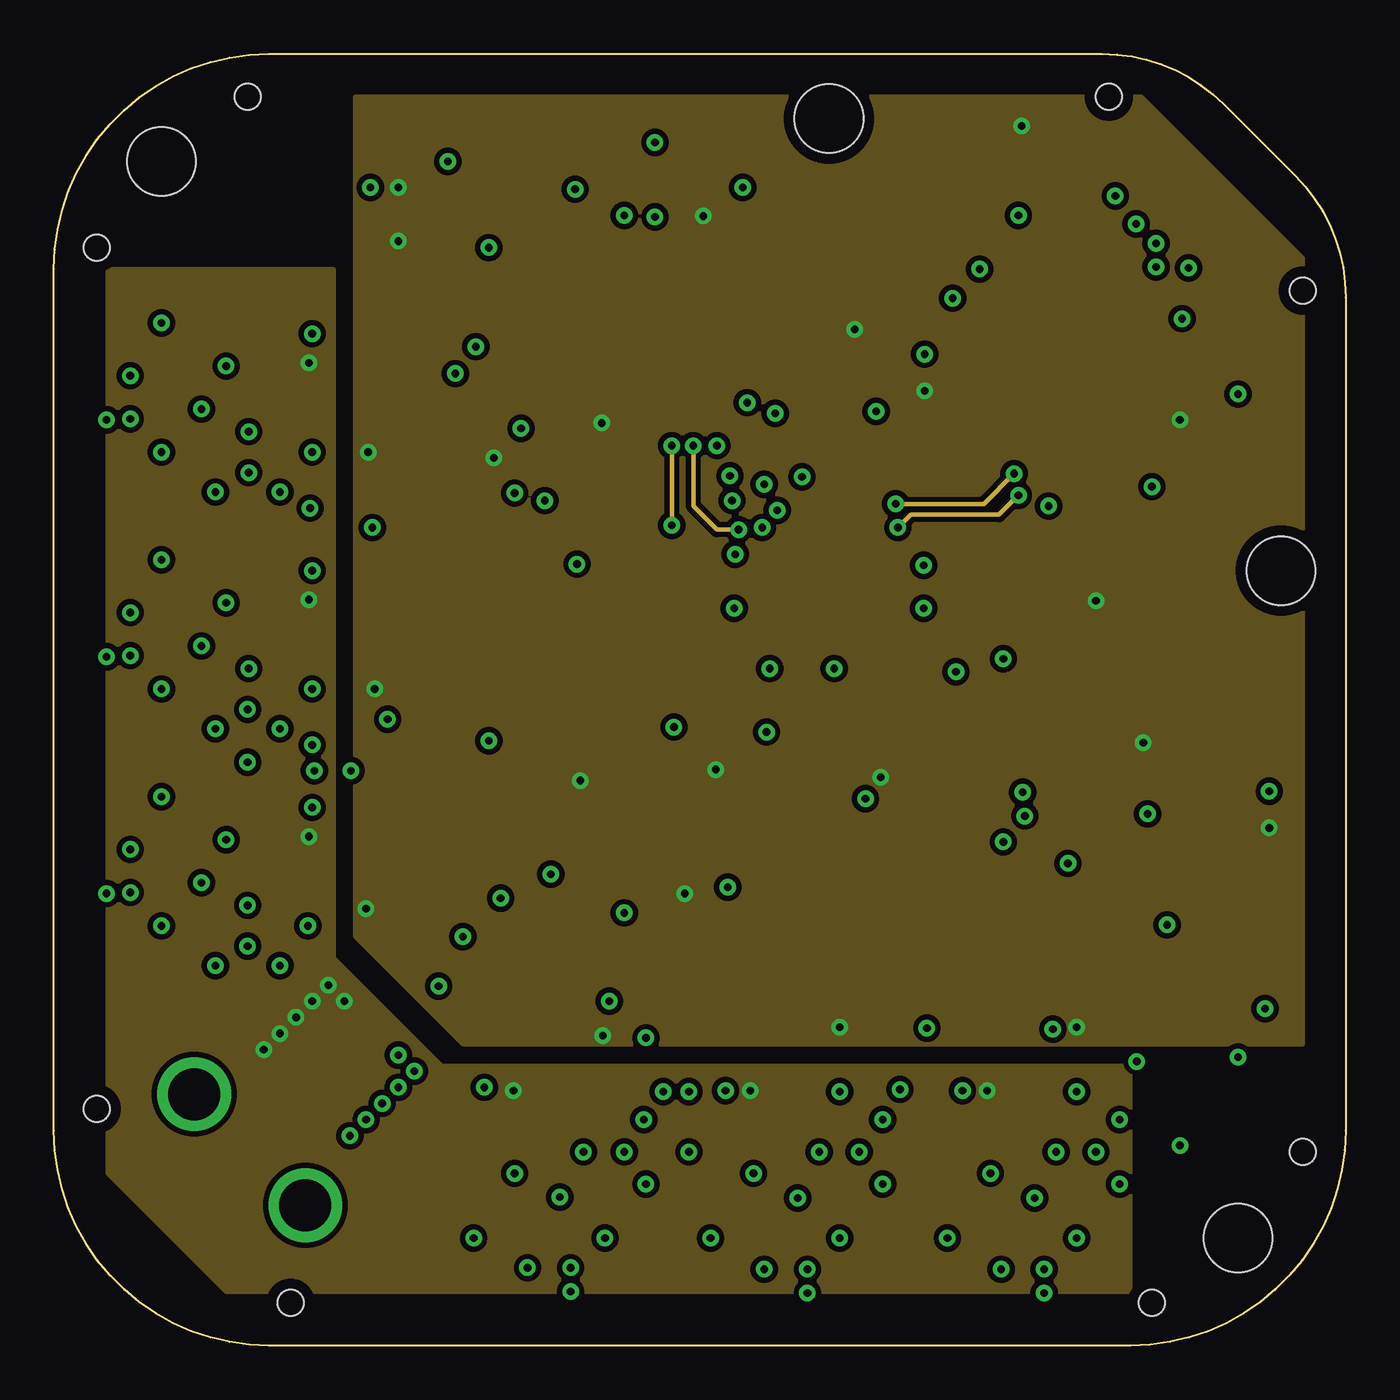
[diagram p3: board, inner layer Route15]
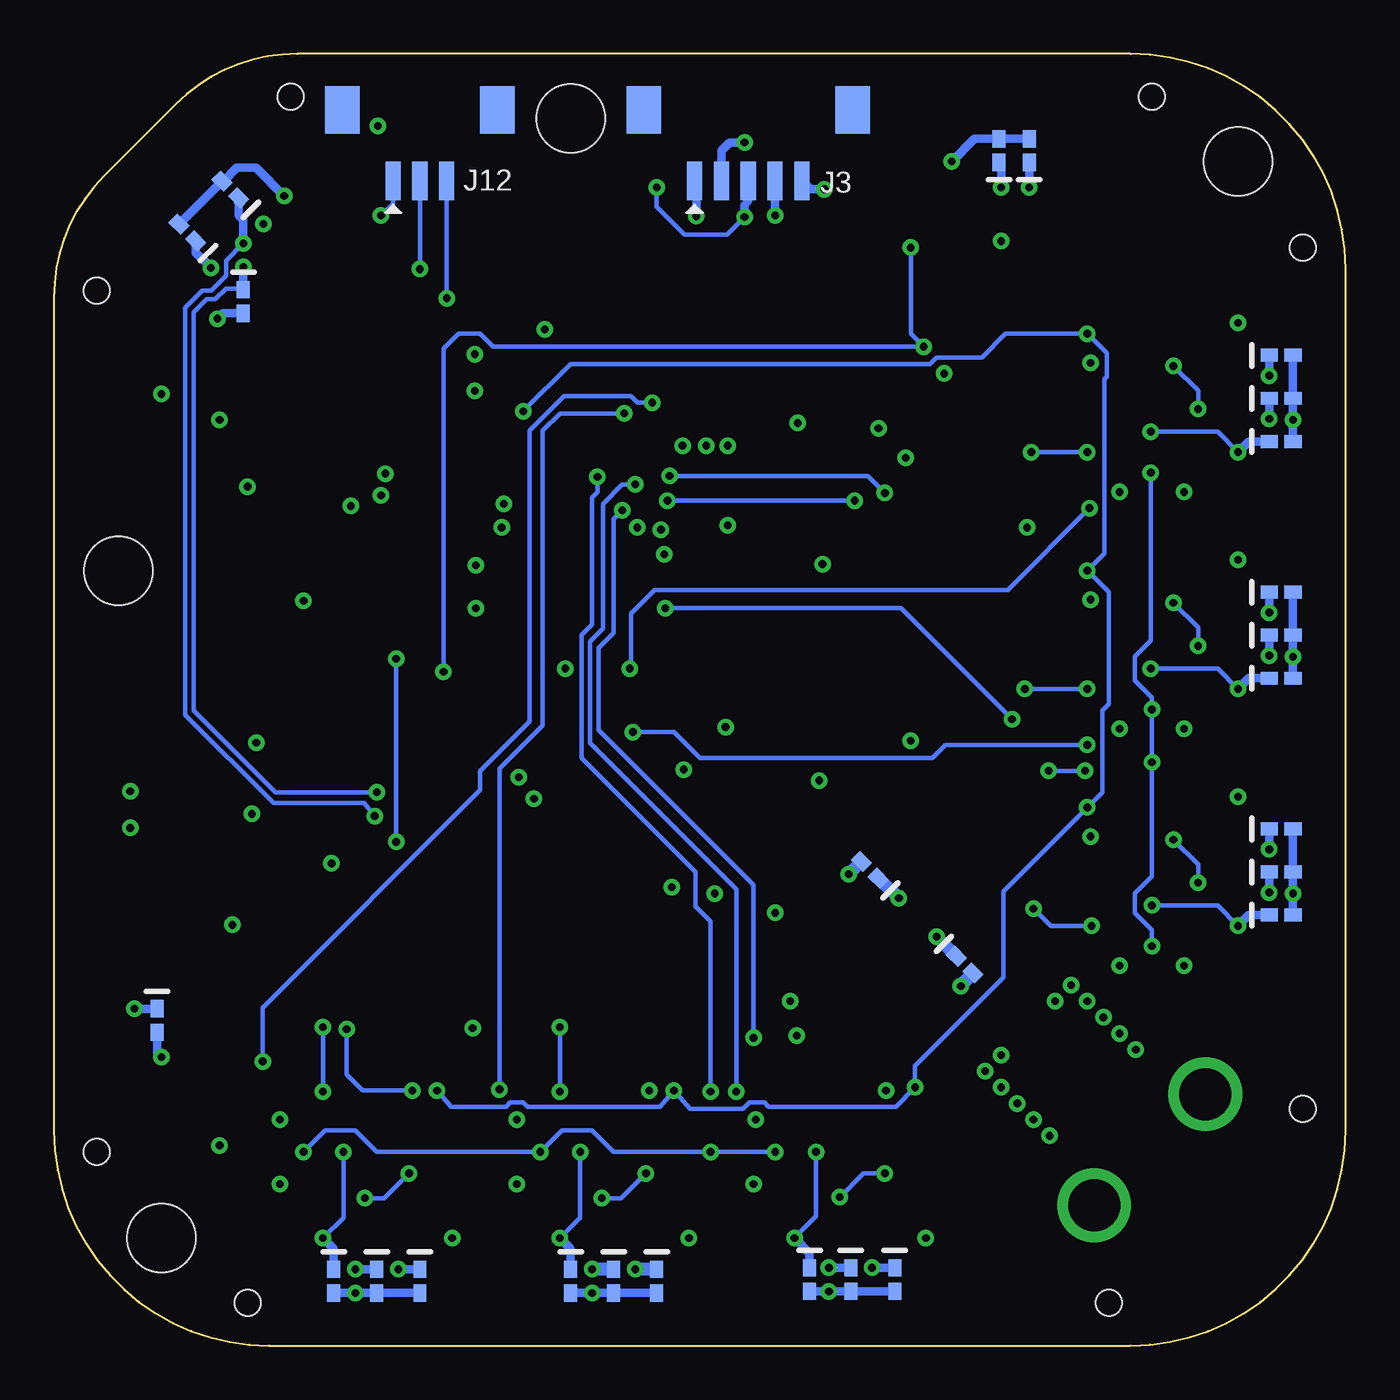
[diagram p4: board, bottom side, seen from below]

Size 60 x 60 mm. Coordinates in mm from the lower left corner, seen from the top.
Outline: 10,60 48.69,60 arc-45 54.34,57.66 57.66,54.34 arc-45 60,48.69 60,10 arc-90 50,0 10,0 arc-90 0,10 0,50 arc-90 10,60
Copper layers (1*2*15*16): Top 0.035mm / dielectric 0.17mm / Route2 0.0175mm / dielectric 0.355mm / Route15 0.0175mm / dielectric 0.17mm / Bottom 0.035mm
Design rules "default *": minimum track width 7mil, minimum drill 14mil, track to track 6mil, track to pad 6mil, pad to pad 6mil, via to via 6mil, smd to smd 0mil, copper to edge 20mil, drill to drill 7mil, minimum pad ring 10mil, minimum via ring 8mil, stop-mask expansion 4mil, vias tented up to drill 0mil, thermal gap 10mil
Holes 3.17 mm at 36,57 57,36 55,5 5,55
Holes 1.2 mm at 51,2 58,9 9,58 2,51 11,2 2,11 58,49 49,58

### Footprints (pad centres in the part's own frame; a part is rotated, then mirrored left to right if it is on the bottom)
CAP_0603 = smd 1 x 1: P$1 -0.85,0; P$2 0.85,0
LED_0603 = smd 1 x 1: A -0.85,0; K 0.85,0
LED_0603_OSRAM = smd 0.8 x 0.8: A -0.75,0; K 0.75,0
FB_0603 = smd 1 x 1: P$1 -0.85,0; P$2 0.85,0
10118192-0001LF = smd 0.4 x 1.35: P$1 -1.3,-0.675; P$2 -0.65,-0.675; P$3 0,-0.675; P$4 0.65,-0.675; P$5 1.3,-0.675 | smd 2.1 x 1.6: P$6 -3.1,-0.8; P$7 3.1,-0.8 | smd 1.8 x 1.9: P$8 -3.8,-3.35; P$9 3.8,-3.35 | smd 1.9 x 1.9: P$10 -1.2,-3.35; P$11 1.2,-3.35
MOLEX_MICROFIT_2POS_SMT_RA_W_BOSSES = drill 2.41: BOSS1 -3.65,-6.93; BOSS2 3.65,-6.93 | smd 1.27 x 3: P1 1.5,-1.5; P2 -1.5,-1.5
DF13-5P-1.25H = smd 0.7 x 1.8: P$1 -1.25,-0.9; P$2 0,-0.9; P$3 1.25,-0.9; P$4 2.5,-0.9; P$5 3.75,-0.9 | smd 1.6 x 2.2: PAD1 -3.6,2.4; PAD2 6.1,2.4
MOLEX_MICROLOCK_RA_4_POS = smd 0.8 x 1.2: P1 2.5,0; P2 1.25,0; P3 0,0; P4 -1.25,0 | smd 1.3 x 2.15: PAD1 -3.15,2.295; PAD2 4.4,2.295
MOLEX_MICROLOCK_RA_2_POS = smd 0.8 x 1.2: P1 2.5,0; P2 1.25,0 | smd 1.3 x 2.15: PAD1 -0.65,2.295; PAD2 4.4,2.295
MOLEX_MICROLOCK_RA_3_POS = smd 0.8 x 1.2: P1 2.5,0; P2 1.25,0; P3 0,0 | smd 1.3 x 2.15: PAD1 -1.9,2.295; PAD2 4.4,2.295
DF13-3P-1.25H = smd 0.7 x 1.8: P$1 -1.25,-0.9; P$2 0,-0.9; P$3 1.25,-0.9 | smd 1.6 x 2.2: PAD1 -3.6,2.4; PAD2 3.6,2.4
RES_0603 = smd 1 x 1: P$1 -0.85,0; P$2 0.85,0
KMR2 = smd 0.9 x 1: P1 -2.05,0.8; P2 2.05,0.8; P3 -2.05,-0.8; P4 2.05,-0.8
CL-SB-22B-12T = smd 1.2 x 1.4: 1 -2.5,-2.2; 2 -2.5,2.2; 3 0,-2.2; 4 0,2.2; 5 2.5,-2.2; 6 2.5,2.2
TP_1P6_MM_ROUND = smd 1.6 x 1.6: P$1 0,0
SOD523 = smd 0.8 x 0.6: A -0.55,0; K 0.55,0
LQFP64_0P5MM_10X10MM = smd 0.4 x 1.5: 1 -3.81,-5.9; 16 3.81,-5.9; 33 3.81,5.9; 48 -3.81,5.9 | smd 0.28 x 1.5: 2 -3.25,-5.9; 3 -2.75,-5.9; 4 -2.25,-5.9; 5 -1.75,-5.9; 6 -1.25,-5.9; 7 -0.75,-5.9; 8 -0.25,-5.9; 9 0.25,-5.9; 10 0.75,-5.9; 11 1.25,-5.9; 12 1.75,-5.9; 13 2.25,-5.9; 14 2.75,-5.9; 15 3.25,-5.9; 34 3.25,5.9; 35 2.75,5.9; 36 2.25,5.9; 37 1.75,5.9; 38 1.25,5.9; 39 0.75,5.9; 40 0.25,5.9; 41 -0.25,5.9; 42 -0.75,5.9; 43 -1.25,5.9; 44 -1.75,5.9; 45 -2.25,5.9; 46 -2.75,5.9; 47 -3.25,5.9 | smd 1.5 x 0.4: 17 5.9,-3.81; 32 5.9,3.81; 49 -5.9,3.81; 64 -5.9,-3.81 | smd 1.5 x 0.28: 18 5.9,-3.25; 19 5.9,-2.75; 20 5.9,-2.25; 21 5.9,-1.75; 22 5.9,-1.25; 23 5.9,-0.75; 24 5.9,-0.25; 25 5.9,0.25; 26 5.9,0.75; 27 5.9,1.25; 28 5.9,1.75; 29 5.9,2.25; 30 5.9,2.75; 31 5.9,3.25; 50 -5.9,3.25; 51 -5.9,2.75; 52 -5.9,2.25; 53 -5.9,1.75; 54 -5.9,1.25; 55 -5.9,0.75; 56 -5.9,0.25; 57 -5.9,-0.25; 58 -5.9,-0.75; 59 -5.9,-1.25; 60 -5.9,-1.75; 61 -5.9,-2.25; 62 -5.9,-2.75; 63 -5.9,-3.25
TOSHIBA_SMV = smd 0.8 x 1: P1 -0.95,-1.2; P3 0.95,-1.2; P4 0.95,1.2; P5 -0.95,1.2 | smd 0.6 x 1: P2 0,-1.2
SOT-23-6_GENERIC = smd 0.55 x 0.9: 1 -0.95,-1.2; 2 0,-1.2; 3 0.95,-1.2; 4 0.95,1.2; 5 0,1.2; 6 -0.95,1.2
SC-70-6_GENERIC = smd 0.42 x 0.77: 1 0.65,0.95; 2 0,0.95; 3 -0.65,0.95; 4 -0.65,-0.95; 5 0,-0.95; 6 0.65,-0.95
SC-70-5_GENERIC = smd 0.42 x 0.77: 1 0.65,0.95; 2 0,0.95; 3 -0.65,0.95; 4 -0.65,-0.95; 5 0.65,-0.95
SOT65P210X110-6N = smd 1.27 x 0.356: 1 -0.914,0.66; 2 -0.914,0; 3 -0.914,-0.66; 4 0.914,-0.66; 5 0.914,0; 6 0.914,0.66
ADXL337 = smd 0.6 x 0.25: P1 -1.4,0.75; P2 -1.4,0.25; P3 -1.4,-0.25; P4 -1.4,-0.75; P9 1.4,-0.75; P10 1.4,-0.25; P11 1.4,0.25; P12 1.4,0.75 | smd 0.25 x 0.6: P5 -0.75,-1.4; P6 -0.25,-1.4; P7 0.25,-1.4; P8 0.75,-1.4; P13 0.75,1.4; P14 0.25,1.4; P15 -0.25,1.4; P16 -0.75,1.4 | smd 1.5 x 1.5: P$17 0,0

### Placement (x,y rotation side)
C1  45.6,33.1 180 top
C2  39.3,45.2 90 top
C3  26.3,37.8 180 top
C4  36.6,26.4 270 top
C5  46.2,37 90 top
C6  26.3,36.3 180 top
C7  44.8,37 90 top
C8  31.33,19.35 90 top
C9  50.4,47.7 0 top
C10  25.82,17.98 270 top
C11  28.48,19.9 180 top
C12  18,51.3 0 top
C13  19.5,42.4 0 top
C14  43.5,15.6 270 top
C15  55.3,24.9 90 top
C16  52.8,24.7 180 top
C17  49.1,22.4 180 top
C18  49.1,20.7 180 top
C19  15.8,46 270 top
D1  20.3,38 180 top
D2  20.3,35.2 180 top
D3  20.3,32.4 180 top
FB1  46.4,34.6 180 top
J1  51.9,51.9 135 top
J2  14,14 315 top
J3  29,55 0 bottom
J4  5,22 90 top
J5  5,33 90 top
J6  5,44 90 top
J7  23,5 180 top
J8  34,5 180 top
J9  45,5 180 top
J10  55,17 270 top
J11  14.75,55 0 top
J12  43,55 0 bottom
R1  49.5,50 270 top
R2  47.9,51.7 270 top
R3  33.8,26.4 90 top
R4  35.2,26.4 90 top
R5  31.59,25.52 180 top
R6  47.3,55.8 90 top
R7  37.2,45.2 270 top
R8  52.3,45 270 top
R9  24.28,17.06 90 top
R10  10.7,24.5 90 top
R11  10.7,35.5 90 top
R12  10.7,46.5 90 top
R13  20.5,10.8 180 top
R14  31.5,10.7 180 top
R15  42.5,10.7 180 top
R16  9.3,49.1 0 top
R17  53.1,15.1 270 top
R18  17.5,46 90 top
R19  17.5,49 90 top
R20  21,49 270 top
R21  23,48.2 90 top
R22  26.3,41.7 180 top
R23  26.3,40.1 180 top
R24  45.3,15.6 270 top
R25  41.7,15.6 90 top
R26  23.3,27.1 270 top
R29  16.8,32.4 0 top
R30  16.8,35.2 0 top
R31  16.8,38 0 top
SW1  45,56 90 top
SW2  56,45 0 top
SW3  21,27.1 270 top
SW4  19,19 45 top
TP1  52.8,26.6 270 top
TP2  52,34.1 270 top
TP3  52,36.5 270 top
TP4  52,38.9 270 top
TP5  52,41.3 270 top
TP6  25.84,33.76 0 top
TP7  29.79,48.04 0 top
TP8  7.7,52.3 0 top
TP9  52.3,7.7 0 top
TP10  27.49,27.42 0 top
TP11  36.89,19.58 0 top
TP12  50.6,26.6 270 top
TVS1  51.8,53.7 315 bottom
TVS2  51.2,48.5 90 bottom
TVS3  22.1,22.1 315 bottom
TVS4  30.16,54.26 270 top
TVS5  27.92,54.26 270 top
TVS6  26.58,54.26 270 top
TVS7  25.24,54.26 270 top
TVS8  45,3 90 bottom
TVS9  43,3 90 bottom
TVS10  47,3 90 bottom
TVS11  34,3 90 bottom
TVS12  32,3 90 bottom
TVS13  36,3 90 bottom
TVS14  22.98,3.07 90 bottom
TVS15  20.94,3.07 90 bottom
TVS16  24.9,3.07 90 bottom
TVS17  3,44 180 bottom
TVS18  3,46 180 bottom
TVS19  3,42 180 bottom
TVS20  3,33 180 bottom
TVS21  3,35 180 bottom
TVS22  3,31 180 bottom
TVS23  3,22 180 bottom
TVS24  3,24 180 bottom
TVS25  3,20 180 bottom
TVS26  53.8,51.7 315 bottom
TVS27  17.7,17.7 135 bottom
TVS28  55.2,15.1 90 bottom
TVS29  16.1,55.5 270 bottom
TVS30  14.7,55.5 270 bottom
U1  36,36 0 top
U2  28.66,17.48 270 top
U3  8,24.5 270 top
U4  7.5,19.5 180 top
U5  10.5,19.5 180 top
U6  7.5,30.5 180 top
U7  10.5,30.5 180 top
U8  7.5,41.5 180 top
U9  10.5,41.5 180 top
U10  25.5,7.5 270 top
U11  25.5,10.5 270 top
U12  36.5,7.5 270 top
U13  36.5,10.5 270 top
U14  47.5,7.5 270 top
U15  47.5,10.5 270 top
U16  8,35.5 270 top
U17  8,46.5 270 top
U18  20.5,8 0 top
U19  31.5,8 0 top
U20  42.5,8 0 top
U21  19.2,49 180 top
U22  21.1,45 90 top
U23  53.2,21.4 315 top

### Tracks (layer width: path | path; a pad name or v marks a point on that pad's centre or on a via)
3V3  (via drill 0.36 pad 0.61)
  Top 0.2: U10.5 23.9,7.5 23.5,7.9 23.5,10.3 23.7,10.5 U11.5 25.2,10.5 25.5,10.8 v25.5,14.4 | U12.5 34.9,7.5 34.4,8 34.4,10.3 34.6,10.5 U13.5 36.2,10.5 36.5,10.8 v36.5,11.8 | U14.5 45.9,7.5 45.3,8.1 45.3,10.3 45.5,10.5 U15.5 47.2,10.5 47.5,10.8 v47.5,11.8 | R17.P$2 48.05,14.25 v47.5,14.8 | U8.5 7.5,43 7.7,43.2 10.3,43.2 10.5,43 U9.5 10.5,41.8 10.8,41.5 v12,41.5 | U6.5 7.5,32 7.7,32.2 10.3,32.2 10.5,32 U7.5 10.5,30.8 10.8,30.5 v12,30.5 | U4.5 7.5,21 7.7,21.2 10.3,21.2 10.5,21 U5.5 10.5,19.8 10.8,19.5 v11.8,19.5 | C15.P$1 v56.45,24.05 | TP12.P$1 v50.6,28 | v30.74,26.76 R5.P$2 | R8.P$2 v52.3,43 52,42.7 TP5.P$1 | R6.P$2 v44.95,56.65 | v25.45,42.85 R22.P$2 R23.P$2 25.45,39.25 25.8,38.9 26.9,38.9 27.15,38.65 C3.P$1 | R26.P$2 v24.45,26.25 | U22.1 20.44,42.49 | 20.44,42.49 C13.P$2 | 20.44,42.49 v20.44,41.24 | U21.5 17.6,49.95 R19.P$2 17.5,50.95 C12.P$1 | C12.P$1 17.1,51.25 | C12.P$1 v16,51.3 | C2.P$1 v40.45,44.35 | R7.P$1 v37.2,47.2 | TP11.P$1 36.89,15.19 v36.5,14.8 | TP7.P$1 29.8,50 30.16,50.36 v30.16,52.46
  Top 0.225: U23.P14 U23.P15 54.45,23 55.1,23 55.3,23.2 C15.P$1
  Top 0.28: U1.8 35.75,29.15 36.6,28.3 C4.P$1 37.55,27.25 v38.4,26.4 | C7.P$1 44.85,36.1 | C7.P$1 C5.P$1 46.95,36.15 47.25,35.85 FB1.P$1 v48.4,34.6 | U1.24 43.45,35.75 43.85,36.15 C7.P$1 | U1.56 27.2,36.25 C6.P$1 C3.P$1 | U1.34 39.25,44.3 C2.P$1
  Top 0.4: v16,53.8 J11.P2 | v30.16,52.46 TVS4.K
  Top 0.6: C8.P$1 31.26,18.43 U2.P5 29.86,19.37 C11.P$1 29.3,19.93 v29.3,21
  Bottom 0.2: v47.5,11.8 v47.5,14.8 | v36.5,11.8 v36.5,14.8 | v11.8,19.5 13.7,19.5 v14.5,20.3 | v12,30.5 v14.9,30.5 | v12,41.5 v14.6,41.5
  Bottom 0.4: TVS29.K 16,54.85 v16,53.8 | J3.P$1 30.25,53.8 TVS4.K v30.16,52.46
  pour Route15 (isolate 0.25): 14,19 19,14 58,14 58,50.5 50.5,58 14,58
+6V  (via drill 0.36 pad 0.61)
  Top 0.2: 49.5,47.75 C9.P$1
  Top 0.28: J1.P$1 52.7,50.86 v52.7,50.06 51.79,49.15 R1.P$2 49.5,47.75
  Bottom 0.4: TVS26.K 53.41,50.77 v52.7,50.06
ACCEL_TEST
  Top 0.2: U23.P2 52,22.95 52,23.1 52.8,23.9 TP1.P$1
ACCEL_XOUT
  Top 0.2: U23.P5 51.04,20.3 50.35,20.3 C18.P$1 49.1,21.55 49.1,24.6 45.8,27.9 39.3,27.9 38.75,28.45 U1.14
ACCEL_YOUT
  Top 0.2: U23.P4 51.14,22.4 C17.P$1 49.7,22.65 49.7,24.7 46,28.4 39.7,28.4 39.25,28.85 U1.15
ACCEL_ZOUT
  Top 0.2: U23.P16 54,23.26 54,24.35 C16.P$1 54,25.05 54,27.3 51.2,30.1 U1.16
AMP_NEG
  Top 0.2: U22.5 21.1,48.05 R20.P$2 | U21.3 20.9,48.05 R20.P$2 | R21.P$1 22.95,47.35 22.2,48.1 21.05,48.1 R20.P$2
AUX_BTN
  Top 0.2: R26.P$1 23.3,29.2 | U1.59 26.75,34.75 26.5,35 25.2,35 23.3,33.1 23.3,29.2 | SW3.P1 23.25,29.15 23.3,29.2
BATT_DIV2  (via drill 0.36 pad 0.61)
  Top 0.2: R24.P$1 C14.P$1 R25.P$2 41.7,21 v44.1,23.4 | v44.1,31.9 43.25,32.75 U1.18
  Bottom 0.2: v44.1,23.4 v44.1,31.9
CLKOUT
  Top 0.2: U1.61 TP6.P$1
FC0_MOSI  (via drill 0.36 pad 0.61)
  Top 0.2: U4.3 v9,18.55 | U8.3 v9.05,40.55 | U6.3 v9,29.55 | U1.63 28.95,32.75 28.3,32.1 28.3,30.7 24.7,27.1 18.5,27.1 18.1,26.7 v13.8,26.7 | v12.1,26.7 10.3,26.7 9.9,27.1 v9,27.1
  Bottom 0.2: v9.05,40.55 9.05,32.75 9.8,32 9.8,30.9 9,30.1 v9,29.55 v9,27.1 9,21.8 9.8,21 9.8,20.1 9,19.3 v9,18.55 | v13.8,26.7 v12.1,26.7
FC0_SCK  (via drill 0.36 pad 0.61)
  Top 0.2: U5.3 11.95,18.55 12.9,19.5 12.9,29.1 | 12.9,29.5 12.9,39.9 12.25,40.55 U9.3 | U7.3 12.85,29.55 12.9,29.5 | 12.9,29.5 12.9,29.1 | 12.9,29.1 v15.5,29.1 | U1.60 v31.6,34.25
  Bottom 0.2: v15.5,29.1 20.65,34.25 v31.6,34.25
FC1_RXD  (via drill 0.36 pad 0.61)
  Top 0.2: v43,50 42.5,49.5 41.3,49.5 40.9,49.1 40.9,48.1 41.2,47.8 41.2,41.2 40.3,40.3 40.3,37.9 38.7,36.3 38.7,33.2 37.25,31.75 U1.11
  Bottom 0.2: v43,50 J12.P$2
FC1_TXD  (via drill 0.36 pad 0.61)
  Top 0.2: U1.12 37.75,31.65 39.1,33 39.1,36.1 40.7,37.7 40.7,40.1 41.75,41.15 v41.75,48.65
  Bottom 0.2: J12.P$3 v41.75,48.65
FC2_MOSI  (via drill 0.36 pad 0.61)
  Top 0.2: U10.3 26.5,8.2 v26.5,9 | U12.3 37.4,8.2 v37.4,9 | U14.3 48.4,8.15 v48.4,9 | v29.5,9 v29.5,11.8 | U1.43 v34.75,40.35
  Bottom 0.2: v48.4,9 47.4,10 46,10 45,9 v37.4,9 36.4,10 35,10 34,9 v29.5,9 v26.5,9 | v29.5,11.8 29.5,19.7 30.2,20.4 30.2,22 35.5,27.3 35.5,33 35,33.5 35,39.4 34.75,39.65 v34.75,40.35
FC2_SCK  (via drill 0.36 pad 0.61)
  Top 0.2: 26.8,11.2 26.5,11.2 U11.3 27.05,11.15 27.5,11.6 27.5,12.6 | 27.5,12.6 37.4,12.6 | U13.3 37.4,11.2 37.4,12.6 | 37.4,12.6 47.9,12.6 48.45,12.05 U15.3 | 27.5,12.6 v27.5,14.3 | U1.45 33.75,39.65 33.6,39.5 v33.6,38.8
  Bottom 0.2: v27.5,14.3 27.5,21.4 34.7,28.6 34.7,32.4 34,33.1 34,38.4 v33.6,38.8
FC5_SCL
  Top 0.2: U1.54 28.45,37.25 28,37.7 28,39.25 R23.P$1 27.15,40.15 26.3,41 26.3,43.2 25.41,44.09 U22.3
FC5_SDA
  Top 0.2: U1.51 29.05,38.75 28.6,39.2 28.6,39.5 28,40.1 28,40.85 R22.P$1 27.15,43.15 24.39,45.91 U22.4
FC6_RXD  (via drill 0.36 pad 0.61)
  Top 0.2: U1.39 36.75,40.15 37.8,39.1 v39.1,39.1 | v44.6,40.5 48,40.5 TP3.P$1
  Route15 0.2: v39.1,39.1 43.2,39.1 v44.6,40.5
FC6_TXD  (via drill 0.36 pad 0.61)
  Top 0.2: v44.8,39.5 45.5,39.5 45.8,39.8 46.6,39.8 47,39.4 47,39.1 TP2.P$1 | v39.2,38 38.3,38 36.25,40.05 U1.40
  Route15 0.2: v44.8,39.5 43.9,38.6 39.8,38.6 v39.2,38
GND  (via drill 0.36 pad 0.61)
  Top 0.2: C15.P$2 v56.45,25.75 | C16.P$2 v50.8,24.7 | C18.P$2 C17.P$2 v47.1,22.4 | R2.P$1 49.15,52.55 49.3,52.7 v49.3,53.4 | C14.P$2 R25.P$1 v40.55,14.75 | SW2.P3 v55,44.2 | SW1.P1 44.2,53.1 v44.8,52.5 | SW3.P3 v20.2,28.1 | C13.P$1 v18.65,45.15 | v18.65,45.15 R18.P$1 C19.P$2 | U22.2 21.1,43.2 v21.7,42.6 | 18.8,51.25 C12.P$2 19.2,50.95 U21.2 19.2,47.2 18.65,46.65 v18.65,45.15 | R29.P$1 R30.P$1 R31.P$1 v14.8,38 | R16.P$1 6.8,49.1 | C4.P$2 36.75,25.4 v37.7,25.4 | U1.9 v36.25,31.45 | TP4.P$1 v51,39.9 | TP8.P$1 6.8,51.4 6.8,49.1 | 6.8,49.1 U17.1 | TP10.P$1 v28.8,28.73 | TP9.P$1 v52.3,9.3
  Top 0.225: v51.7,19.55 U23.P7 U23.P6
  Top 0.28: C7.P$2 C5.P$2 v46.2,39 | v40.4,34.25 U1.21 U1.20 43.45,33.75 44.1,33.1 C1.P$2 | U1.25 v40.4,36.25 | C3.P$2 C6.P$2 v24.3,36.3 | U1.55 v31.65,36.75 | C2.P$2 v40.45,46.05 | J1.P$5 v50.26,52.1 | C9.P$2 v52.4,47.7
  Top 0.4: U10.2 v27.5,7.5 | U11.2 v27.4,10.5 | U12.2 v38.5,7.5 | U13.2 v38.5,10.5 | U15.2 v49.5,10.5 | U14.2 v49.5,7.5 | J10.P1 v55,13.4 | U6.2 v7.5,28.65 | U7.2 v10.5,28.65 | U4.2 v7.5,17.65 | U5.2 v10.5,17.65 | U8.2 v7.5,39.65 | U9.2 v10.5,39.65 | J11.P1 v18.3,55 | TVS7.A TVS6.A TVS5.A | TVS5.A TVS4.A | TVS5.A v27.92,55.88
  Top 0.5: 6.75,25.5 U3.1 | 6.75,36.5 U16.1 | 6.75,47.5 U17.1
  Top 0.6: J9.P1 v41.5,5 41.55,5.05 U20.1 | J8.P1 v30.5,5 30.55,5 U19.1 | J7.P1 v19.5,5 19.55,5 U18.1 | J4.P1 v5,25.5 6.75,25.5 | J5.P1 v5,36.5 6.75,36.5 | J6.P1 v5,47.5 6.75,47.5 | U2.P2 26.17,17.48 C10.P$2 25.8,17.11 v25.8,16 | C11.P$2 27.43,20.1 v26.5,20.1 | C8.P$2 31.3,20.23 v31.3,21.3
  Bottom 0.2: J12.P$1 44.25,53.05 v44.8,52.5
  Bottom 0.4: TVS13.A v35,2.45 TVS11.A TVS12.A | TVS10.A v46,2.45 TVS8.A TVS9.A | TVS16.A v24,2.52 TVS14.A TVS15.A | TVS28.A 55.2,13.6 v55,13.4 | TVS19.A v2.45,43 TVS17.A TVS18.A | TVS22.A v2.45,32 TVS20.A TVS21.A | TVS25.A v2.45,21 TVS23.A TVS24.A | TVS30.A TVS29.A 17.25,56.05 v18.3,55 | J3.P$2 29,55.5 28.62,55.88 v27.92,55.88 | v49.3,53.4 50.6,54.7 51.5,54.7 52.11,54.09 TVS1.A TVS26.A | TVS2.A 52.15,47.95 v52.4,47.7
  Bottom 0.6: TVS27.A v17.87,16.7 | TVS3.A v23.08,21.9
  other vias: 16,13.5 13.75,9.75 14.5,10.5 15.25,11.25 16,12 16.75,12.75
  pour Route2 (isolate 0.25): 58.5,47.6 58.5,10.5 arc-90 49.5,1.5 10.5,1.5 arc-90 1.5,10.5 1.5,49.5 arc-90 10.5,58.5 47.6,58.5 arc-45 52.55,56.45 56.45,52.55 arc-45
  pour Top (no thermals): 15.75,14.75 11.75,10.75 13.75,8.75 17.75,12.75
GREEN_LED1  (via drill 0.36 pad 0.61)
  Top 0.2: U1.49 30.1,40.2 30.3,40.4 v31.4,40.4 | D1.A 21.4,38.25 v21.4,39.6
  Bottom 0.2: v21.4,39.6 22.2,40.4 v31.4,40.4
GREEN_LED2  (via drill 0.36 pad 0.61)
  Top 0.2: D2.A 21.15,35.25 22.3,36.4 22.3,38.75 v22.8,39.25 | v31.5,39.25 U1.50
  Bottom 0.2: v31.5,39.25 v22.8,39.25
ISP0
  Top 0.2: R8.P$1 53.9,45.85 SW2.P1 55.4,45.8 55.8,45.4 55.8,42.8 53.9,40.9 53.9,33.2 51.2,30.5 40.8,30.5 40,31.3 38.4,31.3 38.25,31.15 U1.13
ISP1
  Top 0.2: U1.38 37.25,44.3 R7.P$2
LED_PWR_EN  (via drill 0.36 pad 0.61)
  Top 0.2: U18.5 20.5,11.5 v20,12 | U19.5 31.5,11.5 v31.2,11.85 | U20.5 42.5,11.55 v42.2,11.85 | U3.5 11.5,24.5 v12,25 | U16.5 11.5,35.5 v12,36 | U17.5 11.5,46.5 v12,47 12,48.1 11,49.1 R16.P$2 | U1.36 38.25,43.35 v38.2,43.4
  Bottom 0.2: v42.2,11.85 41.55,11.1 39,11.1 38.8,11.3 38.2,11.3 38,11.1 31.85,11.1 v31.2,11.85 30.45,11 28,11 27.7,11.3 27,11.3 26.8,11.1 20.9,11.1 v20,12 20,13 15.9,17.1 15.9,21.1 v12,25 11.3,25.7 11.3,29.5 11,29.8 11,35 v12,36 11.2,36.8 11.2,44.9 11.1,45 11.1,46.1 v12,47 15.8,47 16.9,45.9 19,45.9 19.3,45.6 36,45.6 v38.2,43.4
MIC_AMP_OUT  (via drill 0.36 pad 0.61)
  Top 0.2: U22.6 20.44,46.4 v19.6,46.4 | R21.P$2 22.95,49 20.2,49 19.85,49.35 U21.4 19.85,50.65 v20.2,51 | v41.9,31.3 U1.17
  Bottom 0.2: v20.2,51 20.2,47 v19.6,46.4 39.6,46.4 40.2,47 41.2,47 41.9,46.3 v41.9,31.3
MIC_IN  (via drill 0.36 pad 0.61)
  Top 0.2: R20.P$1 21,51.7 20.5,52.2 16.3,52.2 v14.7,53.8
  Top 0.4: v14.7,53.8 14.75,53.85 J11.P3
  Bottom 0.4: TVS30.K v14.7,53.8
N$1
  Top 0.2: U3.6 10.6,25.45 R10.P$2
N$2
  Top 0.2: U1.5 34.25,28.65 33.8,28.2 R3.P$2
N$3
  Top 0.2: U1.6 34.75,28.65 35.2,28.2 R4.P$2
N$4  (via drill 0.36 pad 0.61)
  Top 0.2: R4.P$1 35.2,24.8 35.4,24.6 43.9,24.6 v45,25.7 | v51.2,50.1 52.1,51 52.1,51.2 52.2,51.3 52.22,51.3 J1.P$2
  Bottom 0.2: v45,25.7 49.7,25.7 53.5,29.5 53.5,48 52.9,48.6 52.5,48.6 52,49.1 51.25,49.1 TVS2.K
  Bottom 0.4: v51.2,50.1 TVS2.K
N$5  (via drill 0.36 pad 0.61)
  Top 0.2: R5.P$1 33.77,25.52 R3.P$1 33.8,24.5 34.1,24.2 44.7,24.2 v45.1,24.6 | v51.2,51.2 J1.P$3
  Bottom 0.2: v45.1,24.6 45.6,25.2 49.8,25.2 53.9,29.3 53.9,48.2 53.1,49 52.7,49 52,49.7 52,50.4 v51.2,51.2
  Bottom 0.4: TVS1.K 51.41,52.51 51.2,52.3 v51.2,51.2
N$6
  Top 0.2: R9.P$1 25.24,15.25 27.2,15.25 27.46,15.51 U2.P3
N$10
  Top 0.2: D3.K R29.P$2
N$11
  Top 0.2: D2.K R30.P$2
N$12
  Top 0.2: D1.K R31.P$2
N$16
  Top 0.2: U20.6 41.55,10.6 R15.P$2
N$17
  Top 0.2: U16.6 10.6,36.45 R11.P$2
N$19
  Top 0.2: U17.6 10.6,47.45 R12.P$2
N$21
  Top 0.2: U18.6 19.55,10.7 R13.P$2
N$23
  Top 0.2: U19.6 30.55,10.6 R14.P$2
RED_LED1
  Top 0.2: D3.A 21.9,32.4 24.9,35.4 27.1,35.4 27.25,35.25 U1.58
RESET_N  (via drill 0.36 pad 0.61)
  Top 0.2: R6.P$1 47.3,54.2 47.05,53.95 SW1.P3 45.8,54.7 45.3,55.2 38.6,55.2 37.2,53.8 v32,53.8 | v32.9,38 32.9,37.4 32.4,36.9 32.4,33.3 31.29,32.19 U1.64 | v30.8,41.8 30.8,42.7 27.92,45.58 v27.92,52.42
  Top 0.4: TVS5.K v27.92,52.42
  Route2 0.2: v32.9,38 32.9,38.9 32.8,38.9 32.2,39.5 32.2,41.4 31.8,41.8 v30.8,41.8
  Bottom 0.2: v32,53.8 32,52.9 30.7,51.6 28.74,51.6 v27.92,52.42
  Bottom 0.4: v27.92,52.42 27.92,52.98 27.75,53.15 J3.P$3
STRING1_CLK  (via drill 0.36 pad 0.61)
  Top 0.2: J4.P3 5.2,22.2 10.6,22.2 11.15,21.65 U5.4
  Top 0.4: J4.P3 4.05,22 3.55,21.5 v3.55,21.05
  Bottom 0.4: v3.55,21.05 TVS23.K
STRING1_DATA  (via drill 0.36 pad 0.61)
  Top 0.2: U4.4 v9,20.45
  Top 0.4: v5,19.5 J4.P4
  Bottom 0.2: v5,19.5 5.95,20.45 v9,20.45
  Bottom 0.4: TVS25.K 4.5,20 v5,19.5
STRING1_EN
  Top 0.2: U4.1 6.85,18.35 6.7,18.2 6.7,17.2 7,16.9 9.7,16.9 | U5.1 9.85,18.35 9.7,18.2 9.7,16.9 | 9.7,16.9 11.1,16.9 12.5,18.3 13.6,18.3 19,23.7 26.5,23.7 30.5,27.7 31.8,27.7 32.19,28.09 U1.1
STRING1_V+  (via drill 0.36 pad 0.61)
  Top 0.2: v6.85,21.5 U4.6 6.85,19.85 7.1,19.6 9.6,19.6 9.85,19.85 U5.6 | v8,23.5 6.85,23.5 U3.3
  Top 0.4: v3.55,23.05 4.8,23.05 J4.P2
  Top 0.55: U3.2 U3.3
  Top 0.6: J4.P2 6.5,23.25 U3.3
  Bottom 0.2: v6.85,21.5 6.85,22.35 v8,23.5
  Bottom 0.4: TVS24.K v3.55,23.05
STRING2_CLK  (via drill 0.36 pad 0.61)
  Top 0.2: J5.P3 5.2,33.2 10.6,33.2 11.15,32.65 U7.4
  Top 0.4: J5.P3 4.05,33 3.55,32.5 v3.55,32.05
  Bottom 0.4: TVS20.K 3.55,32.5 v3.55,32.05
STRING2_DATA  (via drill 0.36 pad 0.61)
  Top 0.2: U6.4 v9.05,31.45
  Top 0.4: v5,30.5 J5.P4
  Bottom 0.2: v5,30.5 5.95,31.45 v9.05,31.45
  Bottom 0.4: TVS22.K 4.5,31 v5,30.5
STRING2_EN  (via drill 0.36 pad 0.61)
  Top 0.2: U6.1 6.85,29.35 6.7,29.2 6.7,28.3 7.1,27.9 9.7,27.9 | U7.1 9.85,29.35 9.7,29.2 9.7,27.9 | 9.7,27.9 v12,27.9 | v33.1,28.5 32.75,28.85 U1.2
  Bottom 0.2: v12,27.9 18.6,27.9 19.2,27.3 30,27.3 31.2,28.5 v33.1,28.5
STRING2_V+  (via drill 0.36 pad 0.61)
  Top 0.2: v6.85,32.5 U6.6 6.85,30.85 7.1,30.6 9.6,30.6 9.85,30.85 U7.6 | v8,34.5 6.85,34.5 U16.3
  Top 0.4: v3.55,34.05 4.8,34.05 J5.P2
  Top 0.55: U16.2 U16.3
  Top 0.6: J5.P2 6.5,34.25 U16.3
  Bottom 0.2: v6.85,32.5 6.85,33.35 v8,34.5
  Bottom 0.4: TVS21.K v3.55,34.05
STRING3_CLK  (via drill 0.36 pad 0.61)
  Top 0.2: J6.P3 5.2,44.2 10.5,44.2 11.15,43.55 U9.4
  Top 0.4: J6.P3 4.05,44 3.55,43.5 v3.55,43.05
  Bottom 0.4: TVS17.K 3.55,43.5 v3.55,43.05
STRING3_DATA  (via drill 0.36 pad 0.61)
  Top 0.2: U8.4 v9.05,42.45
  Top 0.4: v5,41.5 J6.P4
  Bottom 0.2: v5,41.5 5.95,42.45 v9.05,42.45
  Bottom 0.4: TVS19.K 4.5,42 v5,41.5
STRING3_EN  (via drill 0.36 pad 0.61)
  Top 0.2: U8.1 6.85,40.35 6.7,40.2 6.7,39.2 7,38.9 9.7,38.9 | U9.1 9.85,40.35 9.7,40.2 9.7,38.9 | 9.7,38.9 v11.9,38.9 | v33.25,31.45 U1.3
  Bottom 0.2: v11.9,38.9 15.7,35.1 32.1,35.1 33.2,34 33.2,31.5 v33.25,31.45
STRING3_V+  (via drill 0.36 pad 0.61)
  Top 0.2: v6.85,43.5 U8.6 6.85,41.85 7.1,41.6 9.6,41.6 9.85,41.85 U9.6 | v8,45.5 6.85,45.5 U17.3
  Top 0.4: v3.55,45.05 4.8,45.05 J6.P2
  Top 0.55: U17.2 U17.3
  Top 0.6: J6.P2 6.5,45.25 U17.3
  Bottom 0.2: v6.85,43.5 6.85,44.35 v8,45.5
  Bottom 0.4: TVS18.K v3.55,45.05
STRING4_CLK  (via drill 0.36 pad 0.61)
  Top 0.2: U11.4 24.5,11.1 23.5,11.1 22.8,10.4 22.8,5.2 J7.P3
  Top 0.4: v24,3.62 23.38,3.62 23,4 J7.P3
  Bottom 0.4: TVS14.K v24,3.62
STRING4_DATA  (via drill 0.36 pad 0.61)
  Top 0.2: v24.6,9 24.6,8.2 U10.4
  Top 0.4: J7.P4 v25.6,5
  Bottom 0.2: v24.6,9 24.6,6 v25.6,5
  Bottom 0.4: TVS16.K 24.9,4.3 v25.6,5
STRING4_EN  (via drill 0.36 pad 0.61)
  Top 0.2: 26.5,9.9 U11.1 26.75,9.85 26.9,9.7 28.3,9.7 | U10.1 26.65,6.85 26.8,6.7 27.9,6.7 28.3,7 28.3,9.7 | 28.3,9.7 v28.3,11.8 | U1.46 33.25,40.95 33,40.7 v33,40
  Bottom 0.2: v28.3,11.8 28.3,21.2 35.1,28 35.1,32.7 34.5,33.3 34.5,39.1 33.6,40 v33,40
STRING4_V+  (via drill 0.36 pad 0.61)
  Top 0.2: U11.6 25.15,9.85 25.5,9.5 25.5,7 25.35,6.85 U10.6 24.5,6.9 v23.5,6.9 | U18.3 21.4,6.85 v21.4,8
  Top 0.4: v22,3.62 21.75,3.87 J7.P2
  Top 0.55: U18.2 U18.3
  Top 0.6: U18.3 21.75,6.5 J7.P2
  Bottom 0.2: v23.5,6.9 22.4,8 v21.4,8
  Bottom 0.4: TVS15.K v22,3.62
STRING5_CLK  (via drill 0.36 pad 0.61)
  Top 0.2: U13.4 34.55,11.15 33.8,10.4 33.8,5.2 J8.P3 33.9,5.1
  Top 0.4: v35,3.55 34.45,3.55 34,4 J8.P3
  Bottom 0.6: TVS11.K v35,3.55
STRING5_DATA  (via drill 0.36 pad 0.61)
  Top 0.2: U12.4 v35.55,9
  Top 0.4: v36.5,5 J8.P4
  Bottom 0.2: v35.55,9 35.55,5.95 v36.5,5
  Bottom 0.4: TVS13.K 36,4.5 v36.5,5
STRING5_EN  (via drill 0.36 pad 0.61)
  Top 0.2: U12.1 37.65,6.85 37.8,6.7 39,6.7 39.3,7 39.3,9.7 | U13.1 37.65,9.85 37.8,9.7 39.3,9.7 | 39.3,9.7 v39.3,11.9 | v33.5,43.3 33,43.3 32.75,43.05 U1.47
  Bottom 0.2: v39.3,11.9 39.3,26.8 37.3,28.8 37.3,42.5 36.5,43.3 v33.5,43.3
STRING5_V+  (via drill 0.36 pad 0.61)
  Top 0.2: U13.6 36.15,9.85 36.5,9.5 36.5,7 36.35,6.85 U12.6 v34.55,6.85 | v32.5,8 32.5,6.85 U19.3
  Top 0.4: v33,3.55 32.75,3.8 J8.P2
  Top 0.55: U19.2 U19.3
  Top 0.6: U19.3 32.75,6.5 J8.P2
  Bottom 0.2: v34.55,6.85 33.65,6.85 v32.5,8
  Bottom 0.6: TVS12.K v33,3.55
STRING6_CLK  (via drill 0.36 pad 0.61)
  Top 0.2: U15.4 45.45,11.15 44.8,10.5 44.8,5.2 J9.P3 44.9,5.1
  Top 0.4: J9.P3 45,4 45.45,3.55 v46,3.55
  Bottom 0.4: TVS8.K v46,3.55
STRING6_DATA  (via drill 0.36 pad 0.61)
  Top 0.2: U14.4 v46.55,9
  Top 0.4: v47.5,5 J9.P4
  Bottom 0.2: v46.55,9 46.55,5.95 v47.5,5
  Bottom 0.4: TVS10.K 47,4.5 v47.5,5
STRING6_EN  (via drill 0.36 pad 0.61)
  Top 0.2: U14.1 48.65,6.85 48.8,6.7 50,6.7 50.3,7 50.3,9.7 | U15.1 48.65,9.85 48.8,9.7 50.3,9.7 | 50.3,9.7 v50.3,13.2 | v32.2,43.8 U1.48
  Bottom 0.2: v50.3,13.2 50.3,15.7 40.2,25.8 40.2,26.7 37.9,29 37.9,42.5 36.3,44.1 33.2,44.1 32.9,43.8 v32.2,43.8
STRING6_V+  (via drill 0.36 pad 0.61)
  Top 0.2: U15.6 47.15,9.85 47.5,9.5 47.5,7 47.35,6.85 U14.6 v45.55,6.85 | v43.5,8 43.5,6.85 U20.3
  Top 0.4: J9.P2 43.75,3.8 v44,3.55
  Top 0.55: U20.2 U20.3
  Top 0.6: J9.P2 43.75,6.5 U20.3
  Bottom 0.2: v45.55,6.85 44.65,6.85 v43.5,8
  Bottom 0.4: TVS9.K v44,3.55
SWCLK  (via drill 0.36 pad 0.61)
  Top 0.2: U1.52 31.45,38.25 v31.8,37.9 31.5,38.2 | v29.7,41.8 29.7,42.6 26.5,45.8 v26.5,52.5
  Top 0.4: v26.5,52.5 26.5,53.63 TVS6.K
  Route15 0.2: v31.8,37.9 30.8,37.9 29.7,39 v29.7,41.8
  Bottom 0.4: J3.P$4 v26.5,52.5
SWDIO  (via drill 0.36 pad 0.61)
  Top 0.2: U1.53 29.05,37.75 v28.7,38.1 | v28.7,41.8 28.7,42.5 25.24,45.96 TVS7.K
  Top 0.4: TVS7.K v24.21,53.71
  Route15 0.2: v28.7,38.1 v28.7,41.8
  Bottom 0.4: v24.21,53.71 24.86,53.71 J3.P$5
USB_VBUS
  Top 0.2: R1.P$1 R2.P$2 43.8,46.75 43.8,37.2 43.35,36.75 U1.26
USER_BTN_IN  (via drill 0.36 pad 0.61)
  Top 0.2: 55.1,15.65 J10.P2 54.8,15.95 R17.P$1 50.85,15.95 45.9,20.9 45.9,26.6 45.3,27.2 38.6,27.2 36.75,29.05 U1.10
  Top 0.4: v56.25,15.65 55.1,15.65
  Bottom 0.4: TVS28.K v56.25,15.65
VBAT  (via drill 0.36 pad 0.61)
  Top 0.2: v46.4,14.7 45.35,14.7 R24.P$2
  Top 0.6: U18.4 21.45,10.7 R13.P$1 v21.35,11.85 | U19.4 32.45,10.6 R14.P$1 v32.35,11.85 | U20.4 43.45,10.6 R15.P$1 v43.35,11.85 | U17.4 10.6,45.55 R12.P$1 v11.85,45.65 | U16.4 10.6,34.55 R11.P$1 v11.85,34.65 | U3.4 10.6,23.55 R10.P$1 v11.85,23.65 | SW4.3 v19,19 | SW4.4 v19,19 | v13.5,16 15.6,16 17.4,17.8 17.8,17.8 v19,19
  Bottom 0.2: v43.35,11.85 45.65,11.85 46.4,12.6 v46.4,14.7
  Bottom 0.6: v19,19 TVS27.K | TVS27.K
  other vias: 12,16 11.25,15.25 10.5,14.5 9.75,13.75 12.75,16.75
  pour Route15 (isolate 0.25): 2.5,8 8,2.5 50,2.5 50,13 18,13 13,18 13,50 2.5,50
  pour Top (no thermals): 14.75,15.75 10.75,11.75 8.75,13.75 12.75,17.75
VBAT_SW  (via drill 0.36 pad 0.61)
  Top 0.6: SW4.6 v20.75,20.79 SW4.5 23.63,17.91 R9.P$2 24.77,18.4 25.2,18.4 25.63,18.83 C10.P$1 26.22,18.43 U2.P1
  Bottom 0.6: v20.75,20.79 21.68,21.71 TVS3.K
VDDA
  Top 0.28: U1.23 U1.22 45.4,34.75 FB1.P$2 45.55,34 C1.P$1
VREF
  Top 0.2: U21.1 18.45,48.15 R19.P$1 R18.P$2 C19.P$1

### Text on the board
tPlace: MIC | RESET | Wedfestdress! | Rev A | V+ | ISP | V+ | S3 | LED1 | LED2 | Rx | Tx | BAD | S2 | BTN2 | +Z | V+ | +X | +Y | S1 | + | BTN | - | S4 | S5 | S6